# Altium project HYDRA_V3_BEACON.PrjPcb (part 1 of 2)
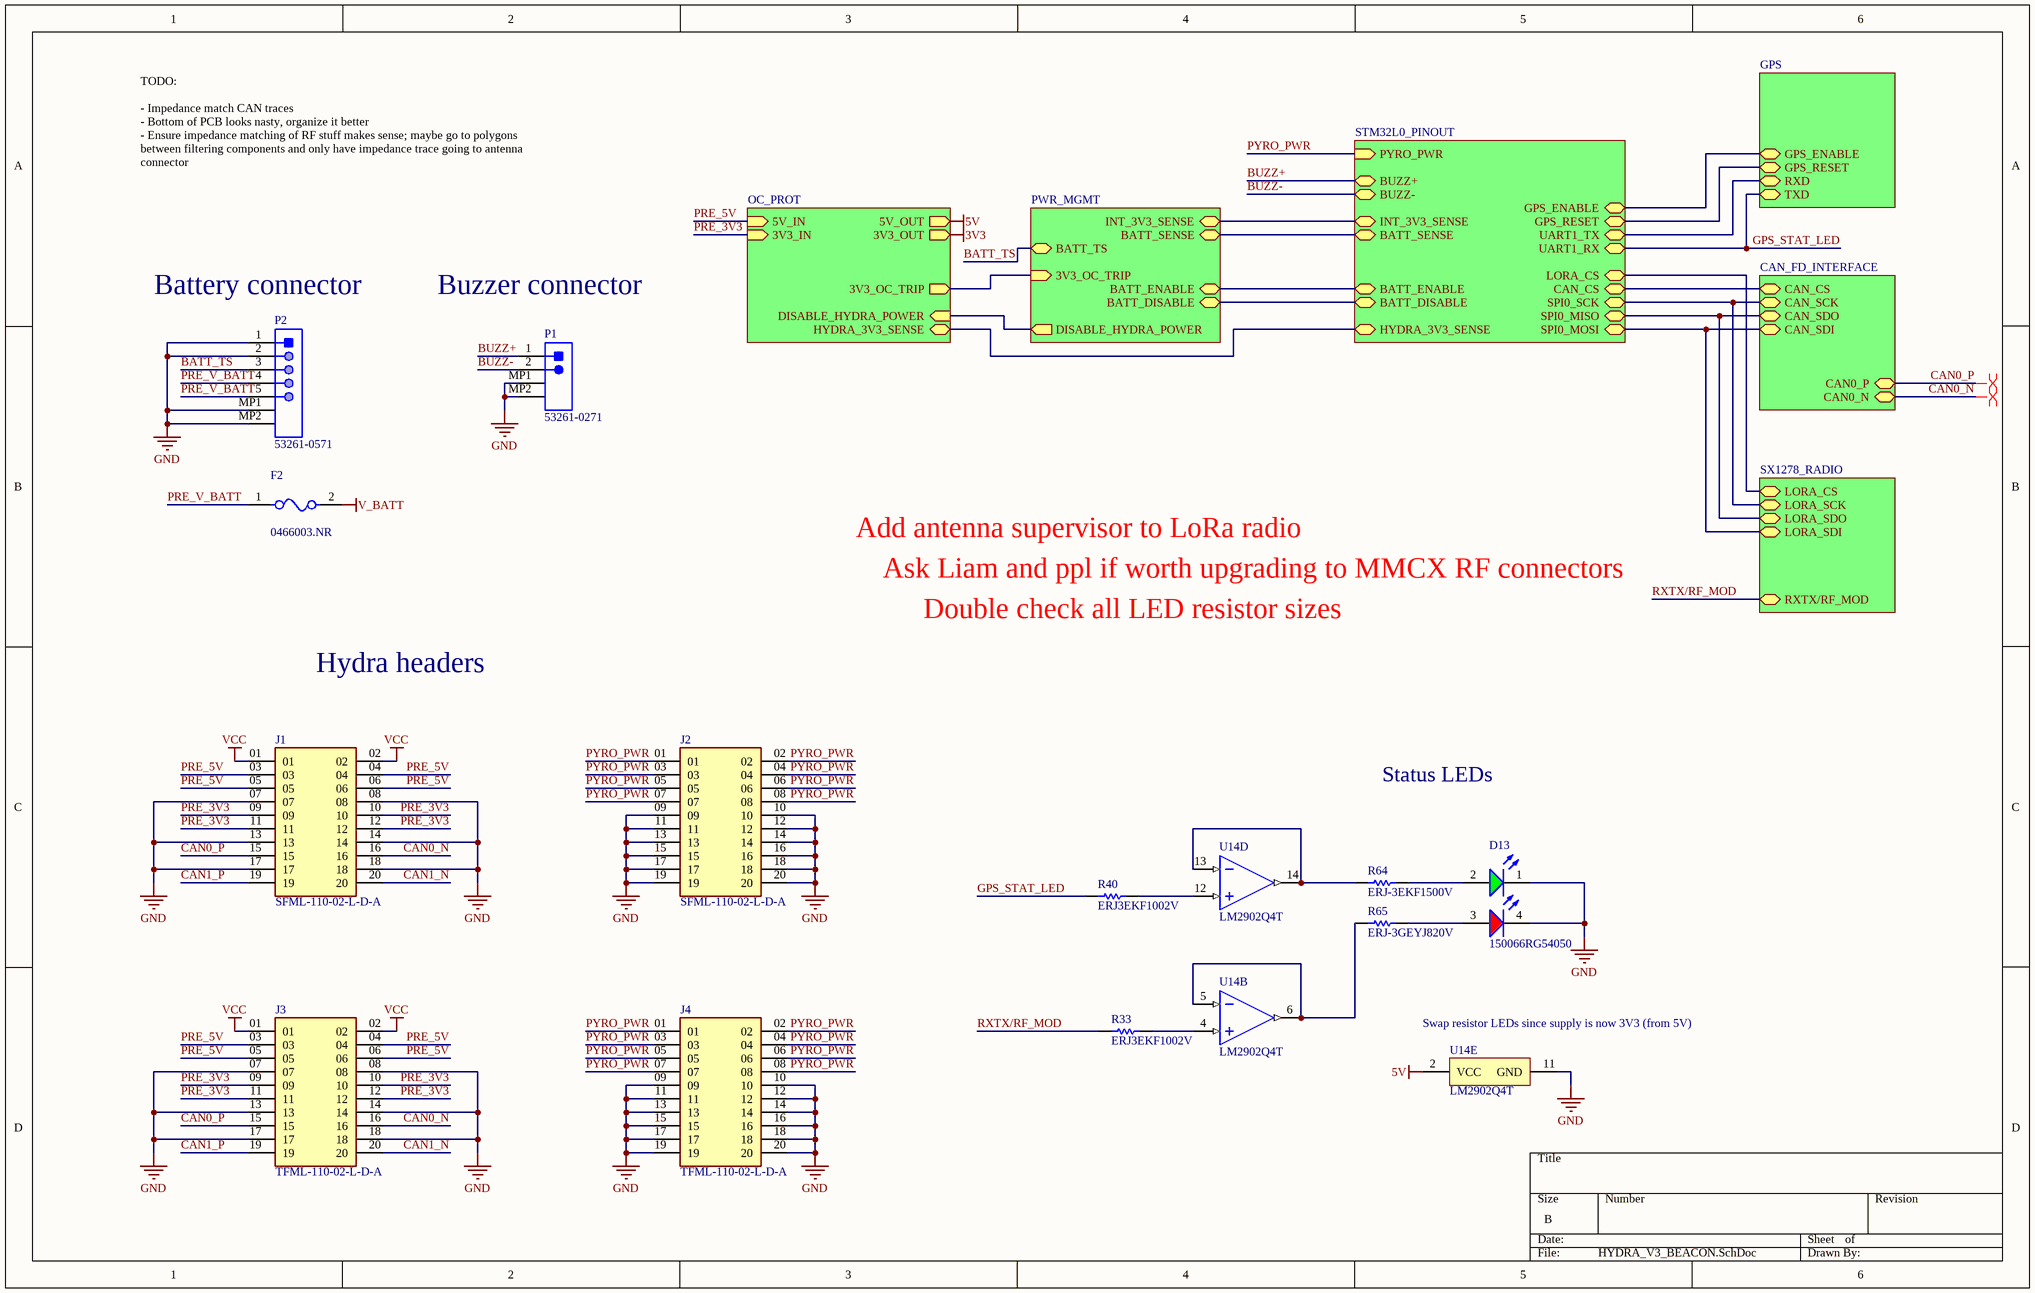
[diagram p0: HYDRA_V3_BEACON.SchDoc]
7 sheets, 171 parts. Net scope: hierarchical (ports join the sheet entries above them; power ports are global).
Board file: HYDRA_V3_BEACON.PcbDoc
Sheets:
  HYDRA_V3_BEACON.SchDoc
    OC_PROT = OC_PROT.SchDoc
    MCU_PINOUT = STM32L0_PINOUT.SchDoc
    CAN_FD = CAN_FD_INTERFACE.SchDoc
    GPS = GPS.SchDoc
    RADIO = SX1278_RADIO.SchDoc
    PWR_MGMT = PWR_MGMT.SchDoc

## Sheet HYDRA_V3_BEACON.SchDoc
size B; SheetNumber: 1; SheetTotal: 7

### Parts
D13  150066RG54050  [WL-SBCD_0606]
F2  0466003.NR  [FP-0466-MFG]
J1  SFML-110-02-L-D-A  [SFML-110-02-L-D-A-Footprint-1]
J2  SFML-110-02-L-D-A  [SFML-110-02-L-D-A-Footprint-1]
J3  TFML-110-02-L-D-A  [TFML-110-02-L-D-A-Footprint-1]
J4  TFML-110-02-L-D-A  [TFML-110-02-L-D-A-Footprint-1]
P1  53261-0271  [MOLX-53261-0271_V]
P2  53261-0571  [MOLX-52361-0571-5_V]
R33  ERJ3EKF1002V  [RESC1609X55X30LL15T15]
R40  ERJ3EKF1002V  [RESC1609X55X30LL15T15]
R64  ERJ-3EKF1500V  [RESC1608X55X30NL15T15]
R65  ERJ-3GEYJ820V  [RESC1608X55X30NL15T15]
U14  LM2902Q4T  [LM2902Q4T-Footprint-1]  (parts B,D,E of 5)

### Sub-sheets
CAN_FD = CAN_FD_INTERFACE: CAN0_P (bidir), CAN0_N (bidir), CAN_SCK (bidir), CAN_SDI (bidir), CAN_SDO (bidir), CAN_CS (bidir)
GPS = GPS: TXD (bidir), RXD (bidir), GPS_ENABLE (bidir), GPS_RESET (bidir)
MCU_PINOUT = STM32L0_PINOUT: PYRO_PWR (in), LORA_CS (bidir), CAN_CS (bidir), SPI0_SCK (bidir), SPI0_MISO (bidir), SPI0_MOSI (bidir), UART1_TX (bidir), UART1_RX (bidir), GPS_ENABLE (bidir), GPS_RESET (bidir), INT_3V3_SENSE (bidir), BATT_SENSE (bidir), BATT_ENABLE (bidir), BATT_DISABLE (bidir), BUZZ+ (bidir), BUZZ- (bidir), HYDRA_3V3_SENSE (bidir)
OC_PROT = OC_PROT: 5V_OUT (out), 5V_IN (in), 3V3_IN (in), 3V3_OUT (out), DISABLE_HYDRA_POWER (in), HYDRA_3V3_SENSE (bidir), 3V3_OC_TRIP (out)
PWR_MGMT = PWR_MGMT: BATT_ENABLE (bidir), BATT_DISABLE (bidir), INT_3V3_SENSE (bidir), BATT_SENSE (bidir), BATT_TS (bidir), DISABLE_HYDRA_POWER (out), 3V3_OC_TRIP (in)
RADIO = SX1278_RADIO: LORA_SCK (bidir), LORA_SDI (bidir), LORA_SDO (bidir), LORA_CS (bidir), RXTX/RF_MOD (bidir)

### Nets
5V: U14.2(VCC) ; sheet OC_PROT/5V_OUT
BUZZ+: J1.01 J1.02 J3.01 J3.02 P1.1 ; sheet MCU_PINOUT/BUZZ+  [also labelled VCC]
GND: D13.1(K) D13.4(K) J1.07 J1.08 J1.13 J1.14 J1.17 J1.18 J2.09 J2.10 J2.11 J2.12 J2.13 J2.14 J2.15 J2.16 J2.17 J2.18 J2.19 J2.20 J3.07 J3.08 J3.13 J3.14 J3.17 J3.18 J4.09 J4.10 J4.11 J4.12 J4.13 J4.14 J4.15 J4.16 J4.17 J4.18 J4.19 J4.20 P1.MP1 P1.MP2 P2.1 P2.2 P2.MP1 P2.MP2 U14.11(GND)
V_BATT: F2.2
3V3_OC_TP: sheet OC_PROT/3V3_OC_TRIP, sheet PWR_MGMT/3V3_OC_TRIP
BATT_DISABLE: sheet MCU_PINOUT/BATT_DISABLE, sheet PWR_MGMT/BATT_DISABLE
BATT_ENABLE: sheet MCU_PINOUT/BATT_ENABLE, sheet PWR_MGMT/BATT_ENABLE
BATT_SENSE: sheet MCU_PINOUT/BATT_SENSE, sheet PWR_MGMT/BATT_SENSE
BATT_TS: P2.3 ; sheet PWR_MGMT/BATT_TS
BUZZ-: P1.2 ; sheet MCU_PINOUT/BUZZ-
CAN0_N: J1.16 J3.16 ; sheet CAN_FD/CAN0_N
CAN0_P: J1.15 J3.15 ; sheet CAN_FD/CAN0_P
CAN1_N: J1.20 J3.20
CAN1_P: J1.19 J3.19
CAN_CS: sheet MCU_PINOUT/CAN_CS, sheet CAN_FD/CAN_CS
CAN_SCK: sheet MCU_PINOUT/SPI0_SCK, sheet CAN_FD/CAN_SCK, sheet RADIO/LORA_SCK
CAN_SDI: sheet MCU_PINOUT/SPI0_MOSI, sheet CAN_FD/CAN_SDI, sheet RADIO/LORA_SDI
CAN_SDO: sheet MCU_PINOUT/SPI0_MISO, sheet CAN_FD/CAN_SDO, sheet RADIO/LORA_SDO
DISABLE_HYDRA_POWER: sheet OC_PROT/DISABLE_HYDRA_POWER, sheet PWR_MGMT/DISABLE_HYDRA_POWER
GPS_ENABLE: sheet MCU_PINOUT/GPS_ENABLE, sheet GPS/GPS_ENABLE
GPS_RESET: sheet MCU_PINOUT/GPS_RESET, sheet GPS/GPS_RESET
GPS_STAT_LED: R40.1 ; sheet MCU_PINOUT/UART1_RX, sheet GPS/TXD
HYDRA_3V3_SENSE: sheet OC_PROT/HYDRA_3V3_SENSE, sheet MCU_PINOUT/HYDRA_3V3_SENSE
INT_3V3_SENSE: sheet MCU_PINOUT/INT_3V3_SENSE, sheet PWR_MGMT/INT_3V3_SENSE
LORA_CS: sheet MCU_PINOUT/LORA_CS, sheet RADIO/LORA_CS
PRE_3V3: J1.09 J1.10 J1.11 J1.12 J3.09 J3.10 J3.11 J3.12 ; sheet OC_PROT/3V3_IN  [project net 3V3_PRE_SHUNT]
PRE_5V: J1.03 J1.04 J1.05 J1.06 J3.03 J3.04 J3.05 J3.06 ; sheet OC_PROT/5V_IN
PRE_V_BATT: F2.1 P2.4 P2.5
PYRO_PWR: J2.01 J2.02 J2.03 J2.04 J2.05 J2.06 J2.07 J2.08 J4.01 J4.02 J4.03 J4.04 J4.05 J4.06 J4.07 J4.08 ; sheet MCU_PINOUT/PYRO_PWR
RXD: sheet MCU_PINOUT/UART1_TX, sheet GPS/RXD
RXTX/RF_MOD: R33.2 ; sheet RADIO/RXTX/RF_MOD
NetD13_2: D13.2(A) R64.2
NetD13_3: D13.3(A) R65.2
NetR33_1: R33.1 U14.4(2IN+)
NetR40_2: R40.2 U14.12(4IN+)
NetR64_1: R64.1 U14.13(4IN-) U14.14(4OUT)
NetR65_1: R65.1 U14.5(2IN-) U14.6(2OUT)

### Layout directives
differential pair: CAN0_N, CAN0_P

### Notes on the sheet
- TODO:
  - Impedance match CAN traces
  - Bottom of PCB looks nasty, organize it better
  - Ensure impedance matching of RF stuff makes sense; maybe go to polygons between filtering components and only have impedance trace going to antenna connector
- (near P2) Battery connector
- Buzzer connector
- Add antenna supervisor to LoRa radio
- Ask Liam and ppl if worth upgrading to MMCX RF connectors
- Double check all LED resistor sizes
- Hydra headers
- Status LEDs
- (near U14) Swap resistor LEDs since supply is now 3V3 (from 5V)

### Library data of the parts
D13 = CMP-004-00034-2: Led, Red/Grn, 180Mcd/230Mcd, 624Nm/525Nm Rohs Compliant: Yes
F2 = CMP-08605-000054-1: FUSE BOARD MNT 3A 32VAC/VDC 1206; Manufacturer: Littelfuse; Fuse Interrupt Ac Current: 50A; Fuse Voltage Drop: 75.99mV; Max Fuse Ac Voltage: 32V; Fuse I2T: 0.576A2Sec; Resistance: 0.019Ω; Fuse Blow Speed: Fast; Value: 0.019Ω; ComponentLink2Description: Datasheet; Fuse Current: 3A; RoHS: TRUE; Mouser Description: Surface Mount Fuses 32V 3A VFA Slimline; Height: 0.66mm; Octopart: https://octopart.com/0466003.nr-littelfuse-565175; Package: 0466; Fuse Interrupt Dc Current: 50A; Manufacturer Part Number: 0466003.NR; Temperature Range Low: -55°C; ComponentLink2URL: https://www.littelfuse.com/~/media/electronics/datasheets/fuses/littelfuse_fuse_466_datasheet.pdf.pdf; Digikey Description: FUSE BOARD MNT 3A 32VAC/VDC 1206; Voltage Rating: 32V; Category: Fuse; Lead Free: Yes; Device Class L2: Fuses; Automotive: No; Max Fuse Dc Voltage: 32V; Temperature Range High: +90°C; Device Class L3: unset; Device Class L1: Circuit Protection; Temperature: -55°C to +90°C
J1 J2 = CMP-002-00076-2: Headers & Wire Housings .050 Tiger Eye High-Reliability Locking Socket Strip
J3 J4 = CMP-002-00077-1: Conn Shrouded Header (4 Sides) HDR 20 POS 1.27mm Solder ST Top Entry SMD TIGER EYE™ Tube
P1 = CMP-2000-05633-1: PicoBlade(TM) Header, Right Angle, -40 to 85 degC, 2-Pin SMD, RoHS, Tape and Reel; Current - Max: 1A; Brand: Molex; Voltage Rating: 125V; Number of Positions: 2; Pitch: 1.25mm; Package Version: Rev. H, 11/2014; Factory Pack Quantity: 1000; Datasheet URL: http://www.molex.com/webdocs/datasheets/pdf/en-us/0532610271_PCB_HEADERS.pdf; Datasheet Version: 03/2016; Housing Material: Thermoplastic; RoHS: Details; Product Type: Headers; Number of Rows: 1; Termination Style: SMD; Mounting Technology: SurfaceMount; Number of Positions / Contacts: 2; Package URL: http://www.molex.com/pdm_docs/sd/532610271_sd.pdf; Mounting Angle: Right; Mounting Style: SMD/SMT; Manufacturer: Molex; Product Category: 1.25mmConnectors; Tradename: PicoBlade; Voltage - Max: 125V; Manufacturer URL: http://www.molex.com/; Series: 53261; Package Description: 2-Leads Header, Pitch 1.25 mm, Mated Height 3.4 mm; Package Reference: 53261-0271; Current Rating: 1A; Contact Plating: Tin; Contact Material: PhosphorBronze; Type: Shrouded; Packaging: Reel
P2 = CMP-2000-05249-1: Male Header, Pitch 1.25 mm, 1 x 5 Position, Height 3.4 mm, RoHS, Tape and Reel; Brand: Molex; Mounting Angle: Right; Number of Positions: 5; Voltage Rating: 125V; Current Rating: 1A; Pitch: 1.25mm; Datasheet Version: Rev. D, 04/2004; Housing Material: Thermoplastic; Series: 53261; RoHS: Details; Product Category: Headers&WireHousings; Datasheet URL: http://datasheet.octopart.com/532610571-Molex-datasheet-8343080.pdf; Manufacturer URL: http://www.molex.com/; Contact Material: PhosphorBronze; Tradename: PicoBlade; Number of Rows: 1; Product Type: Headers; Manufacturer: Molex; Type: Shrouded; Termination Style: SMD; Mounting Style: SMD/SMT; Factory Pack Quantity: 1000; Contact Plating: Tin; Packaging: Reel; Number of Positions / Contacts: 5
R33 R40 = CMP-1012-00623-3: Chip Resistor, 10 KOhm, +/- 1%, 0.1 W, -55 to 155 degC, 0603 (1608 Metric), RoHS, Tape and Reel; Manufacturer: Panasonic; Voltage Rating: 75V; Case\/Package: 0603; Power Rating: 100mW; Resistance: 10KOhm; Temperature Coefficient: 100ppm\/degreesC; Number of Pins: 2; Package Reference: 603; Depth: 0.8mm; Mount: SurfaceMount; Package Description: 2-Pin Surface Mount Device, Body 1.6 x 0.85 mm; Datasheet Version: 02/2017; Length: 1.6mm; Lead Free: LeadFree; Height: 0.45mm; Number of Terminations: 2; Max Power Dissipation: 100mW; Min Operating Temperature: -55degC; Datasheet URL: https://industrial.panasonic.com/cdbs/www-data/pdf/RDA0000/AOA0000C304.pdf; Termination: SMD/SMT; Case Code (Metric): 1608; Case Code (Imperial): 0603; Tolerance: 1%; Max Operating Temperature: 155degC; RoHSCompliant: true; Voltage Rating (DC): 75V; Radiation Hardening: No; Packaging: TapeandReel; Composition: ThickFilm; Mounting Technology: SurfaceMount; Manufacturer URL: http://www.panasonic.com/; Width: 0.031inch; REACH SVHC: NoSVHC; Contact Plating: Tin; Military Standard: Not; Package Quantity: 1
R64 = CMP-2000-00256-1: Manufacturer: Panasonic; Part Number: ERJ-3EKF1500V
R65 = CMP-1012-00048-2: Manufacturer: Panasonic; Part Number: ERJ-3GEYJ820V
U14 = CMP-014-00004-1: LM2902 Series 30 V 1.3 MHz Low-Power Quad Operational Amplifier - QFN-16 (3x3)

## Sheet OC_PROT.SchDoc
size C; SheetNumber: 2; SheetTotal: 7
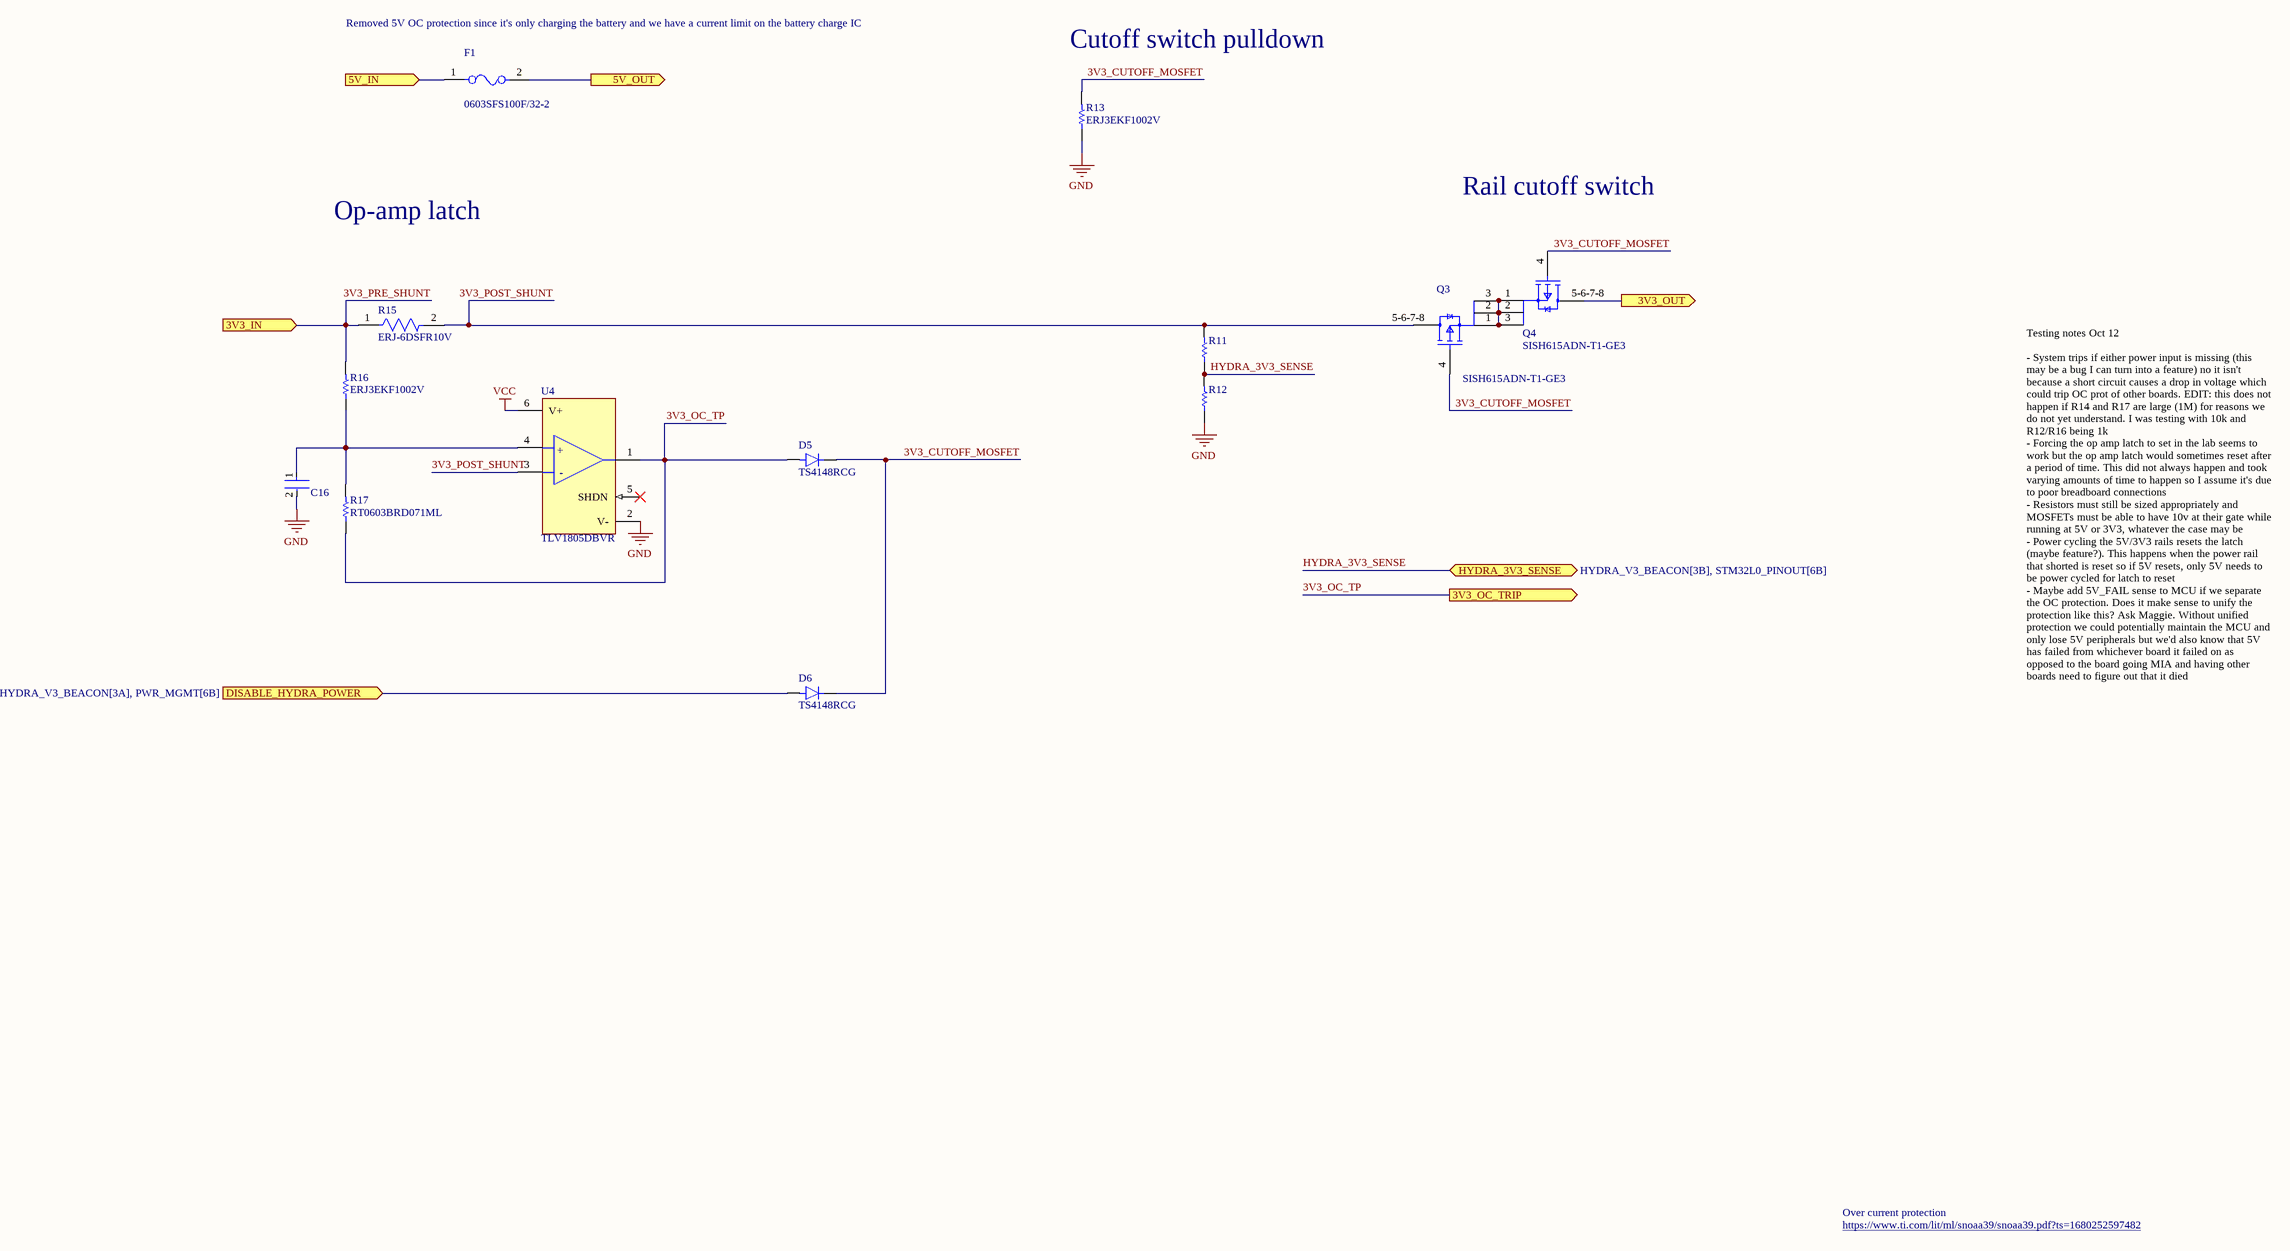
[diagram p1: OC_PROT.SchDoc]

### Parts
C16  C0402C104K8PACTU  [FP-C0402-BB-MFG]  (value not drawn)
D5  TS4148RCG  [TS4148RCG-Footprint-1]
D6  TS4148RCG  [TS4148RCG-Footprint-1]
F1  0603SFS100F/32-2  [FP-0603SFS-MFG]
Q3  SISH615ADN-T1-GE3  [SISH615ADN-T1-GE3-Footprint-1]
Q4  SISH615ADN-T1-GE3  [SISH615ADN-T1-GE3-Footprint-1]
R11  ERJ3EKF1002V  [RESC1609X55X30LL15T15]  (value not drawn)
R12  ERJ3EKF1002V  [RESC1609X55X30LL15T15]  (value not drawn)
R13  ERJ3EKF1002V  [RESC1609X55X30LL15T15]
R15  ERJ-6DSFR10V  [FP-ERJ6D-MFG]
R16  ERJ3EKF1002V  [RESC1609X55X30LL15T15]
R17  RT0603BRD071ML  [RESC1608X55X30NL20T20]
U4  TLV1805DBVR  [FP-DBV0006A-IPC_C]

### Ports
3V3_IN (in, see HYDRA_V3_BEACON[3A]), 3V3_OC_TRIP (out), 3V3_OUT (out, see HYDRA_V3_BEACON[3A]), 5V_IN (in, see HYDRA_V3_BEACON[3A]), 5V_OUT (out, see HYDRA_V3_BEACON[3A]), DISABLE_HYDRA_POWER (in, see HYDRA_V3_BEACON[3A], PWR_MGMT[6B]), HYDRA_3V3_SENSE (bidir, see HYDRA_V3_BEACON[3B], STM32L0_PINOUT[6B])

### Nets
3V3: Q4.5-6-7-8(D) ; port 3V3_OUT
5V: F1.2 ; port 5V_OUT
GND: C16.2 R12.1 R13.1 U4.2(V-)
VCC: U4.6(V+)  [project net BUZZ+]
3V3_CUTOFF_MOSFET: D5.C(K) D6.C(K) Q3.4(G) Q4.4(G) R13.2
3V3_OC_TP: D5.A R17.1 U4.1(OUT) ; port 3V3_OC_TRIP
3V3_POST_SHUNT: Q3.5-6-7-8(D) R11.2 R15.2 U4.3(-IN)
3V3_PRE_SHUNT: R15.1 R16.2 ; port 3V3_IN
DISABLE_HYDRA_POWER: D6.A ; port DISABLE_HYDRA_POWER
HYDRA_3V3_SENSE: R11.1 R12.2 ; port HYDRA_3V3_SENSE
PRE_5V: F1.1 ; port 5V_IN
NetC16_1: C16.1 R16.1 R17.2 U4.4(+IN)
NetQ3_1: Q3.1(S) Q3.2(S) Q3.3(S) Q4.1(S) Q4.2(S) Q4.3(S)

Not connected (* = marked no-connect by the designer): U4 5(SHDN)*

### Notes on the sheet
- Removed 5V OC protection since it's only charging the battery and we have a current limit on the battery charge IC
- Cutoff switch pulldown
- Op-amp latch
- Rail cutoff switch
- Testing notes Oct 12
  - System trips if either power input is missing (this may be a bug I can turn into a feature) no it isn't because a short circuit causes a drop in voltage which could trip OC prot of other boards. EDIT: this does not happen if R14 and R17 are large (1M) for reasons we do not yet understand. I was testing with 10k and R12/R16 being 1k
  - Forcing the op amp latch to set in the lab seems to work but the op amp latch would sometimes reset after a period of time. This did not always happen and took varying amounts of time to happen so I assume it's due to poor breadboard connections
  - Resistors must still be sized appropriately and MOSFETs must be able to have 10v at their gate while running at 5V or 3V3, whatever the case may be
  - Power cycling the 5V/3V3 rails resets the latch (maybe feature?). This happens when the power rail that shorted is reset so if 5V resets, only 5V needs to be power cycled for latch to reset
  - Maybe add 5V_FAIL sense to MCU if we separate the OC protection. Does it make sense to unify the protection like this? Ask Maggie. Without unified protection we could potentially maintain the MCU and only lose 5V peripherals but we'd also know that 5V has failed from whichever board it failed on as opposed to the board going MIA and having other boards need to figure out that it died
- https://www.ti.com/lit/ml/snoaa39/snoaa39.pdf?ts=1680252597482
- Over current protection
- (in symbol CMP-04896-000098-1) +; -

### Library data of the parts
C16 = CMP-2008-02046-2: CAP CER 0.1UF 10V X5R 0402; Manufacturer: Kemet; Material: Ceramic; Capacitance: 0.10 μF; Temperature Coefficient: 15%; Tolerance: 0.1; Value: 0.10 μF; Package: C0402-BB; Temperature: -55°C to +125°C; ComponentLink2Description: Datasheet; Temperature Characteristic: X5R; Device Class L1: Passive Components; Height: 0.55mm; Lead Free: Yes; ComponentLink2URL: https://content.kemet.com/datasheets/KEM_C1002_X7R_SMD.pdf; Device Class L2: Capacitors; Temperature Range Low: -55°C; Temperature Range High: +125°C; RoHS: TRUE; Octopart: https://octopart.com/c0402c104k8pactu-kemet-140039; Automotive: No; Mouser Description: Capacitor 100 nF 10 VDC 0402; Category: Cap; Voltage Rating: 10 V; Digikey Description: CAP CER 0.1UF 10V X5R 0402; Ipc Land Pattern Name: CAPC10050X50; Device Class L3: Ceramic Capacitors; Manufacturer Part Number: C0402C104K8PACTU
D5 D6 = CMP-004-00036-1: SMD Si-Diode 75V 100mA 0603
F1 = CMP-08605-000034-1: FUSE BOARD MOUNT 1A 32VDC 0603; Manufacturer: Littelfuse; Resistance: 0.2Ω; Fuse Interrupt Dc Current: 50A; Max Fuse Dc Voltage: 32V; Fuse I2T: 0.093A2Sec; Fuse Blow Speed: Slow; Value: 0.2Ω; Device Class L1: Circuit Protection; Device Class L3: unset; Category: Fuse; Temperature Range High: +125°C; ComponentLink2Description: Datasheet; Automotive: No; Device Class L2: Fuses; Lead Free: Yes; Fuse Current: 1A; Temperature: -55°C to +125°C; Digikey Description: FUSE BOARD MOUNT 1A 32VDC 0603; ComponentLink2URL: https://www.littelfuse.com/~/media/electronics/datasheets/fuses/littelfuse_fuse_sfs_datasheet.pdf.pdf; Octopart: https://octopart.com/0603sfs100f%2F32-2-littelfuse-74214378; Voltage Rating: 32V; RoHS: TRUE; Manufacturer Part Number: 0603SFS100F/32-2; Package: 0603SFS; Height: 0.95mm; Ipc Land Pattern Name: CAPC16080X80; Temperature Range Low: -55°C
Q3 Q4 = CMP-013-00036-1: Trans MOSFET P-CH 20V 22.1A 8-Pin PowerPAK 1212 EP T/R
R11-R13 R16 = CMP-1012-00623-3: as R33 on sheet HYDRA_V3_BEACON; Number of Pins: 2; Package Reference: 603; Depth: 0.8mm; Mount: SurfaceMount; Package Description: 2-Pin Surface Mount Device, Body 1.6 x 0.85 mm; Datasheet Version: 02/2017; Length: 1.6mm; Lead Free: LeadFree; Height: 0.45mm; Number of Terminations: 2; Max Power Dissipation: 100mW; Min Operating Temperature: -55degC; Datasheet URL: https://industrial.panasonic.com/cdbs/www-data/pdf/RDA0000/AOA0000C304.pdf; Termination: SMD/SMT; Case Code (Metric): 1608; Case Code (Imperial): 0603; Tolerance: 1%; Max Operating Temperature: 155degC; RoHSCompliant: true; Voltage Rating (DC): 75V; Radiation Hardening: No; Packaging: TapeandReel; Composition: ThickFilm; Mounting Technology: SurfaceMount; Manufacturer URL: http://www.panasonic.com/; Width: 0.031inch; REACH SVHC: NoSVHC; Contact Plating: Tin; Military Standard: Not; Package Quantity: 1
R15 = CMP-05422-000098-1: RES 0.1 OHM 1% 1/2W 0805; Temperature Coefficient: 150ppm/°C; Resistance: 100mR; Max Power Dissipation: 500mW; Tolerance: 1%; Length: 0.079inch; Features: Automotive AEC-Q200; Width: 0.049inch; Resistor Type: Thick Film; Case Code (Metric): 2012; Number of Terminations: 2; Max Operating Temperature: 155°C; Case/Package: 0805; Height: 0.028inch; Packaging: Cut Tape; Case Code (Imperial): 0805; Min Operating Temperature: -55°C
R17 = CMP-2000-00925-1: NOT PANASONIC, THIS IS A 1M RESISTORhttps://www.yageo.com/upload/media/product/productsearch/datasheet/rchip/PYu-RT_1-to-0.01_RoHS_L_13.pdf; Part Number: ERA-3AEB163V; Manufacturer: Panasonic
U4 = CMP-04896-000098-1: 40V, RAIL-TO-RAIL INPUT, PUSH-PU

## Sheet STM32L0_PINOUT.SchDoc
size B; SheetNumber: 3; SheetTotal: 7
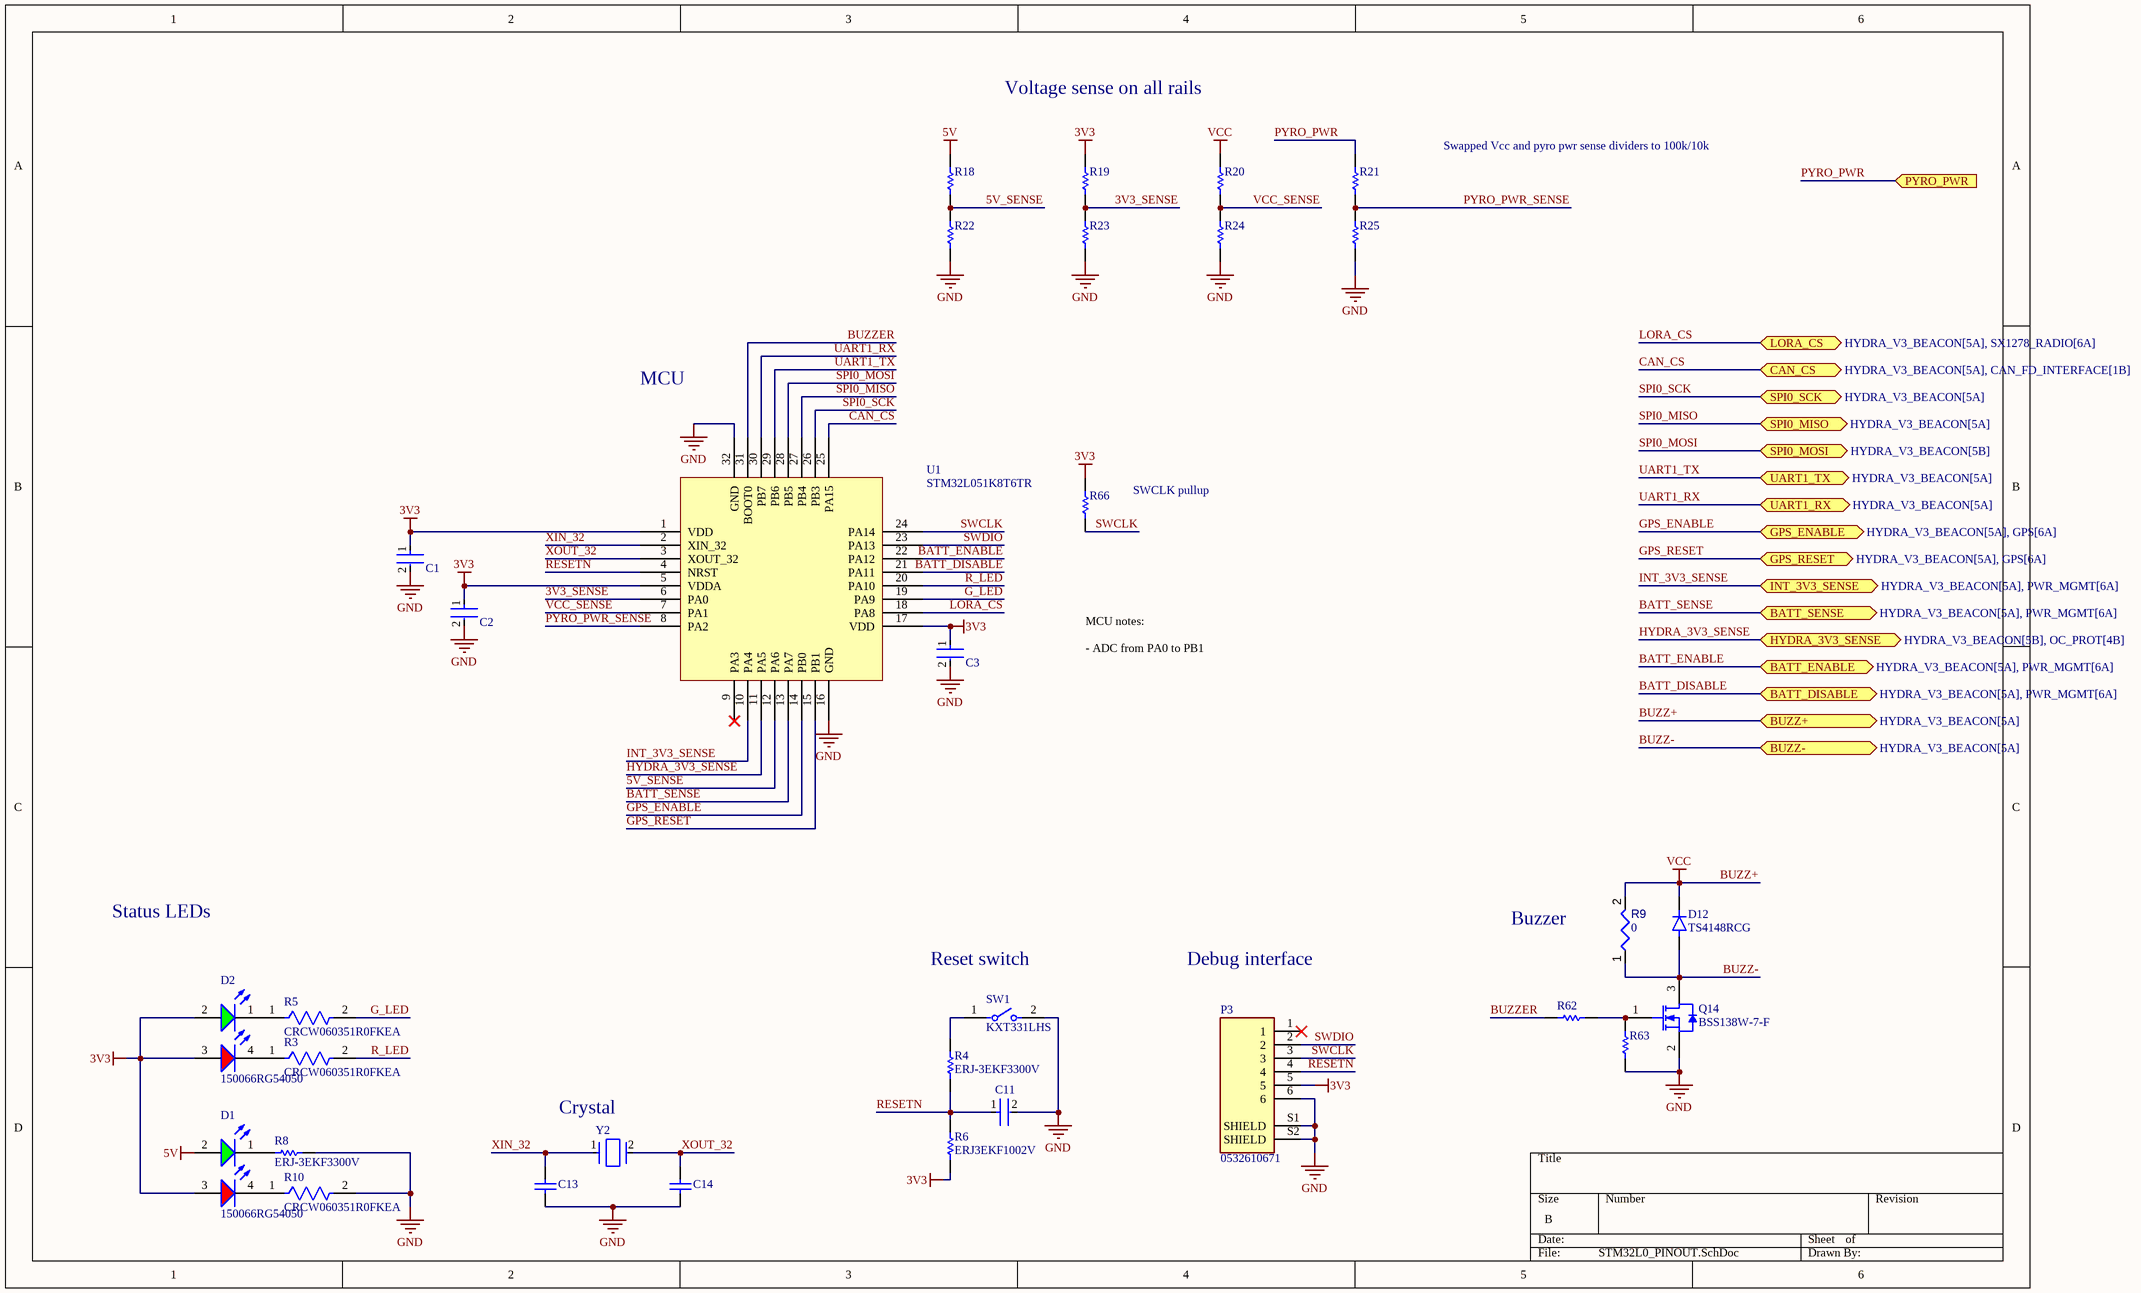
[diagram p2: STM32L0_PINOUT.SchDoc]

### Parts
C1  C0402C104K8PACTU  [FP-C0402-BB-MFG]  (value not drawn)
C2  C0402C104K8PACTU  [FP-C0402-BB-MFG]  (value not drawn)
C3  C0402C104K8PACTU  [FP-C0402-BB-MFG]  (value not drawn)
C11  C0402C104K8PACTU  [FP-C0402-BB-MFG]  (value not drawn)
C13  CC0603JRNPO9BN180  [CAPC1608X90X40LL10T20]  (value not drawn)
C14  CC0603JRNPO9BN180  [CAPC1608X90X40LL10T20]  (value not drawn)
D1  150066RG54050  [WL-SBCD_0606]
D2  150066RG54050  [WL-SBCD_0606]
D12  TS4148RCG  [TS4148RCG-Footprint-1]
P3  0532610671  [0532610671-Footprint-1]
Q14  BSS138W-7-F  [DIOD-SOT323-3_V]
R3  CRCW060351R0FKEA  [FP-CRCW0603-e3-MFG]
R4  ERJ-3EKF3300V  [RESC1608X55X30LL15T15]
R5  CRCW060351R0FKEA  [FP-CRCW0603-e3-MFG]
R6  ERJ3EKF1002V  [RESC1609X55X30LL15T15]
R8  ERJ-3EKF3300V  [RESC1608X55X30LL15T15]
R9  value 0  [RESC0603(1608)_L]  (hidden comment: 0R3J)
R10  CRCW060351R0FKEA  [FP-CRCW0603-e3-MFG]
R18  ERJ3EKF1002V  [RESC1609X55X30LL15T15]  (value not drawn)
R19  ERJ3EKF1002V  [RESC1609X55X30LL15T15]  (value not drawn)
R20  ERJ-3EKF1003V  [RESC1608X55X30ML15T15]  (value not drawn)
R21  ERJ-3EKF1003V  [RESC1608X55X30ML15T15]  (value not drawn)
R22  ERJ3EKF1002V  [RESC1609X55X30LL15T15]  (value not drawn)
R23  ERJ3EKF1002V  [RESC1609X55X30LL15T15]  (value not drawn)
R24  ERJ3EKF1002V  [RESC1609X55X30LL15T15]  (value not drawn)
R25  ERJ3EKF1002V  [RESC1609X55X30LL15T15]  (value not drawn)
R62  ERJ-3EKF1001V  [RESC1608X55X30LL15T15]  (value not drawn)
R63  ERJ3EKF1002V  [RESC1609X55X30LL15T15]  (value not drawn)
R66  ERJ3EKF1002V  [RESC1609X55X30LL15T15]  (value not drawn)
SW1  KXT331LHS  [FP-KXT331LHS-MFG]
U1  STM32L051K8T6TR  [CQFP80P1115X1115X160-32N]
Y2  ECS-.327-12.5-1210-TR  [FP-ECX-1210-MFG]  (value not drawn)

### Ports
BATT_DISABLE (bidir, see HYDRA_V3_BEACON[5A], PWR_MGMT[6A]), BATT_ENABLE (bidir, see HYDRA_V3_BEACON[5A], PWR_MGMT[6A]), BATT_SENSE (bidir, see HYDRA_V3_BEACON[5A], PWR_MGMT[6A]), BUZZ+ (bidir, see HYDRA_V3_BEACON[5A]), BUZZ- (bidir, see HYDRA_V3_BEACON[5A]), CAN_CS (bidir, see HYDRA_V3_BEACON[5A], CAN_FD_INTERFACE[1B]), GPS_ENABLE (bidir, see HYDRA_V3_BEACON[5A], GPS[6A]), GPS_RESET (bidir, see HYDRA_V3_BEACON[5A], GPS[6A]), HYDRA_3V3_SENSE (bidir, see HYDRA_V3_BEACON[5B], OC_PROT[4B]), INT_3V3_SENSE (bidir, see HYDRA_V3_BEACON[5A], PWR_MGMT[6A]), LORA_CS (bidir, see HYDRA_V3_BEACON[5A], SX1278_RADIO[6A]), PYRO_PWR (in, see HYDRA_V3_BEACON[5A]), SPI0_MISO (bidir, see HYDRA_V3_BEACON[5A]), SPI0_MOSI (bidir, see HYDRA_V3_BEACON[5B]), SPI0_SCK (bidir, see HYDRA_V3_BEACON[5A]), UART1_RX (bidir, see HYDRA_V3_BEACON[5A]), UART1_TX (bidir, see HYDRA_V3_BEACON[5A])

### Nets
3V3: C1.1 C2.1 C3.1 D1.3(A) D2.2(A) D2.3(A) P3.5 R6.1 R19.2 R66.2 U1.1(VDD) U1.5(VDDA) U1.17(VDD)
5V: D1.2(A) R18.2
BUZZ+: D12.C(K) R9.2 R20.2 ; port BUZZ+  [also labelled VCC]
GND: C1.2 C2.2 C3.2 C11.2 C13.1 C14.1 P3.6 P3.S1(SHIELD) P3.S2(SHIELD) Q14.2(S) R8.2 R10.2 R22.1 R23.1 R24.1 R25.1 R63.2 SW1.2 U1.16(GND) U1.32(GND)
3V3_SENSE: R19.1 R23.2 U1.6(PA0)
5V_SENSE: R18.1 R22.2 U1.12(PA6)
BATT_DISABLE: U1.21(PA11) ; port BATT_DISABLE
BATT_ENABLE: U1.22(PA12) ; port BATT_ENABLE
BATT_SENSE: U1.13(PA7) ; port BATT_SENSE
BUZZ-: D12.A Q14.3(D) R9.1 ; port BUZZ-
BUZZER: R62.2 U1.31(BOOT0)
CAN_CS: U1.25(PA15) ; port CAN_CS
G_LED: R5.2 U1.19(PA9)
GPS_ENABLE: U1.14(PB0) ; port GPS_ENABLE
GPS_RESET: U1.15(PB1) ; port GPS_RESET
HYDRA_3V3_SENSE: U1.11(PA5) ; port HYDRA_3V3_SENSE
INT_3V3_SENSE: U1.10(PA4) ; port INT_3V3_SENSE
LORA_CS: U1.18(PA8) ; port LORA_CS
PYRO_PWR: R21.2 ; port PYRO_PWR
PYRO_PWR_SENSE: R21.1 R25.2 U1.8(PA2)
R_LED: R3.2 U1.20(PA10)
RESETN: C11.1 P3.4 R4.1 R6.2 U1.4(NRST)
SPI0_MISO: U1.27(PB4) ; port SPI0_MISO  [project net CAN_SDO]
SPI0_MOSI: U1.28(PB5) ; port SPI0_MOSI  [project net CAN_SDI]
SPI0_SCK: U1.26(PB3) ; port SPI0_SCK  [project net CAN_SCK]
SWCLK: P3.3 R66.1 U1.24(PA14)
SWDIO: P3.2 U1.23(PA13)
UART1_RX: U1.30(PB7) ; port UART1_RX  [project net GPS_STAT_LED]
UART1_TX: U1.29(PB6) ; port UART1_TX  [project net RXD]
VCC_SENSE: R20.1 R24.2 U1.7(PA1)
XIN_32: C13.2 U1.2(XIN_32) Y2.1(In/Out)
XOUT_32: C14.2 U1.3(XOUT_32) Y2.2(Out/In)
NetD1_1: D1.1(K) R8.1
NetD1_4: D1.4(K) R10.1
NetD2_1: D2.1(K) R5.1
NetD2_4: D2.4(K) R3.1
NetQ14_1: Q14.1(G) R62.1 R63.1
NetR4_2: R4.2 SW1.1

Not connected (* = marked no-connect by the designer): P3 1*; U1 9(PA3)*

### Notes on the sheet
- Voltage sense on all rails
- Swapped Vcc and pyro pwr sense dividers to 100k/10k
- MCU
- (near R66) SWCLK pullup
- MCU notes:
  - ADC from PA0 to PB1
- Status LEDs
- (near SW1) Reset switch
- Debug interface
- Buzzer
- (near Y2) Crystal

### Library data of the parts
C1-C3 C11 = CMP-2008-02046-2: as C16 on sheet OC_PROT; Package: C0402-BB; Temperature: -55°C to +125°C; ComponentLink2Description: Datasheet; Temperature Characteristic: X5R; Device Class L1: Passive Components; Height: 0.55mm; Lead Free: Yes; ComponentLink2URL: https://content.kemet.com/datasheets/KEM_C1002_X7R_SMD.pdf; Device Class L2: Capacitors; Temperature Range Low: -55°C; Temperature Range High: +125°C; RoHS: TRUE; Octopart: https://octopart.com/c0402c104k8pactu-kemet-140039; Automotive: No; Mouser Description: Capacitor 100 nF 10 VDC 0402; Category: Cap; Voltage Rating: 10 V; Digikey Description: CAP CER 0.1UF 10V X5R 0402; Ipc Land Pattern Name: CAPC10050X50; Device Class L3: Ceramic Capacitors; Manufacturer Part Number: C0402C104K8PACTU
C13 C14 = CMP-1659-00030-1: Chip Capacitor, 18 pF, +/- 5%, 50 V, -55 to 125 degC, 0603 (1608 Metric), RoHS, Tape and Reel; Voltage Rating: 50 V; Case\Package: 0603; Power Rating: 100 mW; Resistance: 68.1 Ohm; Tolerance: 1%; Case Code (Metric): 1608; Max Operating Temperature: 155 degC; RoHSCompliant: true; Case Code (Imperial): 0603; ComponentLink2Description: Datasheet; Package Quantity: 200; PackageReference: 0603; ComponentLink2URL: http://www.yageo.com/NewPortal/yageodocoutput?fileName=/pdf/MLCC/UPY-GP_NP0_16V-to-50V_14.pdf; Length: 1.6 mm; DatasheetVersion: Rev. 14, 07/2016; Min Operating Temperature: -55 degC; ComponentLink1URL: http://www.yageo.com/; Width: 0.8 mm; ComponentLink1Description: Manufacturer URL; Height: 0.45 mm; Radiation Hardening: No; PackageDescription: 2-Pin Surface Mount Device, Body 1.6 x 0.8 mm; Packaging: Tape and Reel
D1 D2 = CMP-004-00034-2: as D13 on sheet HYDRA_V3_BEACON
D12 = CMP-004-00036-1: SMD Si-Diode 75V 100mA 0603
P3 = CMP-002-00079-1: Conn Shrouded Header (4 Sides) HDR 6 POS 1.25mm Solder RA Side Entry SMD PicoBlade™ T/R
Q14 = CMP-2000-05968-1: N-Channel Enhancement Mode Mosfet, 50 V, 200 mA, -55 to 150 degC, 6-Pin SOT-323, RoHS, Tape and Reel; Typical Turn-Off Delay Time: 20ns; Number of Channels: 1Channel; Type: EnhancementModeFieldEffectTransistor; Brand: DiodesIncorporated; Vds - Drain-Source Breakdown Voltage: 75V; Vgs - Gate-Source Voltage: 20V; Rds On - Drain-Source Resistance: 1.4Ohms; Transistor Type: 1N-Channel; Configuration: Single; Unit Weight: 0.000212oz; Pd - Power Dissipation: 200mW; Id - Continuous Drain Current: 200mA; Forward Transconductance - Min: 0.1S; Manufacturer URL: http://www.diodes.com/; Series: BSS138; Package Description: 3-Pin Small Outline Transistor, Body 2 x 1.25 mm, Pitch 0.65 mm; Mounting Technology: SurfaceMount; Product Category: MOSFET; RoHS: True; Maximum Operating Temperature: +150C; Height: 1mm; Length: 2.2mm; Technology: Si; Width: 1.35mm; Datasheet URL: http://www.diodes.com/_files/datasheets/ds30206.pdf; Manufacturer: DiodesIncorporated; Package / Case: SOT-323-3; Typical Turn-On Delay Time: 20ns; Transistor Polarity: N-Channel; Factory Pack Quantity: 3000; Packaging: Reel; Product: MOSFETSmallSignal; Datasheet Version: Rev. 11-2, 09/2013; Package Reference: SOT323; Minimum Operating Temperature: -55C; Mounting Style: SMD/SMT; Channel Mode: Enhancement
R3 R5 R10 = CMP-2000-03446-2: RES Thick Film, 51Ω, 1%, 0.1W, 100ppm/°C, 0603; Power Rating: 100mW; Voltage Rating: 75V; Resistance: 51R; Military Standard: Not; Case Code (Imperial): 0603; Max Operating Temperature: 155°C; Temperature Coefficient: 100ppm/°C; Lead Free: Lead Free; Weight: 7.1E-05oz; Number of Pins: 2; Package Quantity: 10; Case/Package: 0603; Termination: SMD/SMT; Min Operating Temperature: -55°C; Tolerance: 1%; Contact Plating: Tin; Height: 0.45mm; Working Voltage: 75V; Radiation Hardening: No; Packaging: Tape and Reel; Composition: Thick Film; Max Power Dissipation: 100mW; Width: 0.85mm; Depth: 0.85mm; Length: 1.55mm; Case Code (Metric): 1608; Voltage Rating (DC): 75V; Number of Terminations: 2; Features: Automotive AEC-Q200
R4 R8 = CMP-2000-00435-2: Chip Resistor, 330 Ohm, +/- 1%, 0.1 W, -55 to 155 degC, 0603 (1608 Metric), RoHS, Tape and Reel; Gender: Male; Mating Cycles: 10000; Current Rating: 500 mA; Voltage Rating: 10 V; REACH SVHC: No SVHC; PackageDescription: 2-Pin Surface Mount Device, Body 1.6 x 0.85 mm; Contact Finish: Gold; Pins: 8; ComponentLink1Description: Manufacturer URL; Packaging: Tape and Reel; Max Operating Temperature: 85 degC; Contact Material: Copper; Height: 1.45 mm; Width: 1.45 mm; DatasheetVersion: Apr-15; Package Quantity: 1500; Contact Plating: Gold; PackageReference: 0603; Mount: Surface Mount; Lead Pitch: 1.1 mm; Min Operating Temperature: -25 degC; ComponentLink1URL: http://www.panasonic.com/; ComponentLink2URL: http://industrial.panasonic.com/cdbs/www-data/pdf/RDA0000/AOA0000C86.pdf; Length: 13.7 mm; ComponentLink2Description: Datasheet; RoHSCompliant: true
R6 R18 R19 R22-R25 R63 R66 = CMP-1012-00623-3: as R33 on sheet HYDRA_V3_BEACON; Number of Pins: 2; Package Reference: 603; Depth: 0.8mm; Mount: SurfaceMount; Package Description: 2-Pin Surface Mount Device, Body 1.6 x 0.85 mm; Datasheet Version: 02/2017; Length: 1.6mm; Lead Free: LeadFree; Height: 0.45mm; Number of Terminations: 2; Max Power Dissipation: 100mW; Min Operating Temperature: -55degC; Datasheet URL: https://industrial.panasonic.com/cdbs/www-data/pdf/RDA0000/AOA0000C304.pdf; Termination: SMD/SMT; Case Code (Metric): 1608; Case Code (Imperial): 0603; Tolerance: 1%; Max Operating Temperature: 155degC; RoHSCompliant: true; Voltage Rating (DC): 75V; Radiation Hardening: No; Packaging: TapeandReel; Composition: ThickFilm; Mounting Technology: SurfaceMount; Manufacturer URL: http://www.panasonic.com/; Width: 0.031inch; REACH SVHC: NoSVHC; Contact Plating: Tin; Military Standard: Not; Package Quantity: 1
R9 = CMP-009-00063-2: Jumper 0603 (1608 Metric); Case/Package: 0603; Mounting Technology: SMT; Pins: 2
R20 R21 = CMP-2000-00182-1: Manufacturer: Panasonic; Part Number: ERJ-3EKF1003V
R62 = CMP-2000-00180-1: Manufacturer: Panasonic; Part Number: ERJ-3EKF1001V
SW1 = CMP-10040-000029-1: SWITCH TACTILE SPST-NO 0.02A 15V; Operating Force: 240gf; Switch Travel: 0.13mm; Illumination Type: Non-Illuminated; Throw Configuration: SPST; Number of Ports: 1; Current Rating: 5A; Mechanical Life: 500000Cycles; Switch Function: Off-Mom; Connector Type: USB; Actuator Type: Standard; Gender: Receptacle; Number of Contacts: 24; Contact Plating: Gold; Insulation Color: Black; Min Operating Temperature: -40°C; Packaging: Tape and Reel; Flammability Rating: UL94 V-0; Max Operating Temperature: 85°C; Termination: Solder; Mount: Surface Mount
U1 = CMP-020-00025-2: MCU 32-Bit Ultra Low Power STM32L ARM Cortex M0+ RISC 64kB Flash 32-Pin LQFP T/R
Y2 = CMP-40224-000006-1: CRYSTAL 32.7680KHZ 12.5PF SMD; Manufacturer: ECS International; Frequency: 32.768kHz; Esr: 90kΩ; Tolerance: 20ppm; Device Class L1: Passive Components; Load Capacitance: 12.5pF; Temperature: -40°C to +85°C; ComponentLink2URL: https://ecsxtal.com/store/pdf/ECX-1210.pdf; Series: ECX-1210; Octopart: https://octopart.com/ecs-.327-12.5-1210-tr-ecs+international-81221340; ComponentLink2Description: Datasheet; Temperature Range Low: -40°C; Digikey Description: CRYSTAL 32.7680KHZ 12.5PF SMD; Lead Free: Yes; RoHS: TRUE; Device Class L3: Crystals; Automotive: No; Category: Crys; Height: 0.5mm; Manufacturer Part Number: ECS-.327-12.5-1210-TR; Temperature Range High: +85°C; Device Class L2: Crystals / Oscillators; Package: ECX-1210

## Sheet CAN_FD_INTERFACE.SchDoc
size B; SheetNumber: 4; SheetTotal: 7
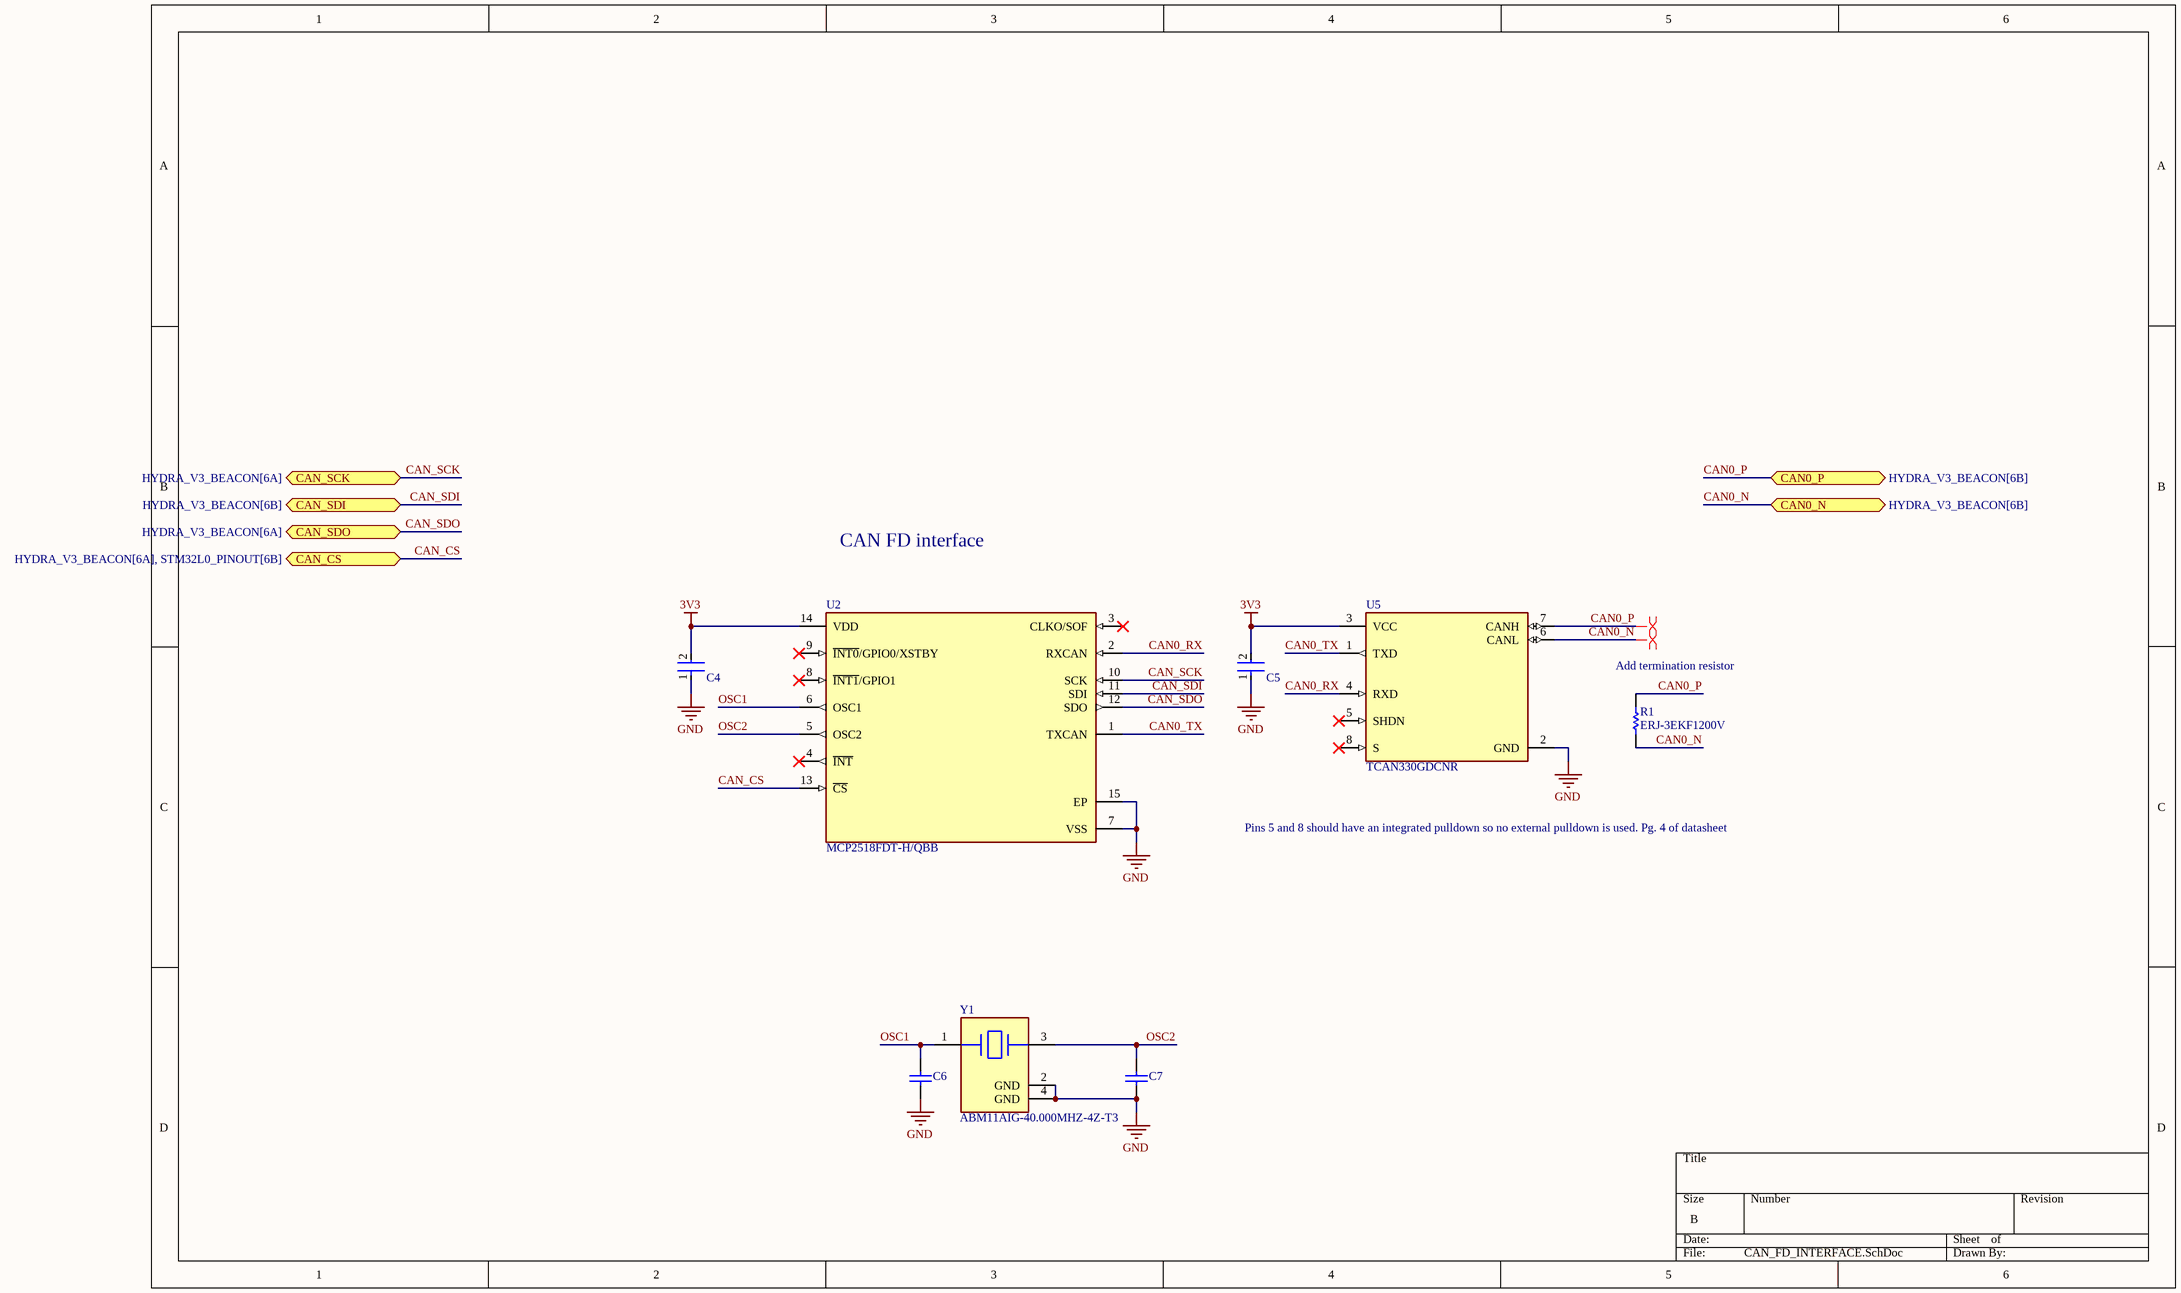
[diagram p3: CAN_FD_INTERFACE.SchDoc]

### Parts
C4  C0402C104K8PACTU  [FP-C0402-BB-MFG]  (value not drawn)
C5  C0402C104K8PACTU  [FP-C0402-BB-MFG]  (value not drawn)
C6  VJ0603D6R8CXPAJ  [CAPC1608X92X38LL15T08]  (value not drawn)
C7  VJ0603D6R8CXPAJ  [CAPC1608X92X38LL15T08]  (value not drawn)
R1  ERJ-3EKF1200V  [RESC1609X55X30ML15T15]
U2  MCP2518FDT-H/QBB  [FP-C04-21361-MFG]
U5  TCAN330GDCNR  [FP-DCN0008A-MFG]
Y1  ABM11AIG-40.000MHZ-4Z-T3  [FP-ABM11AIG-MFG]

### Ports
CAN0_N (bidir, see HYDRA_V3_BEACON[6B]), CAN0_P (bidir, see HYDRA_V3_BEACON[6B]), CAN_CS (bidir, see HYDRA_V3_BEACON[6A], STM32L0_PINOUT[6B]), CAN_SCK (bidir, see HYDRA_V3_BEACON[6A]), CAN_SDI (bidir, see HYDRA_V3_BEACON[6B]), CAN_SDO (bidir, see HYDRA_V3_BEACON[6A])

### Nets
3V3: C4.2 C5.2 U2.14(VDD) U5.3(VCC)
GND: C4.1 C5.1 C6.1 C7.1 U2.7(VSS) U2.15(EP) U5.2(GND) Y1.2(GND) Y1.4(GND)
CAN0_N: R1.1 U5.6(CANL) ; port CAN0_N
CAN0_P: R1.2 U5.7(CANH) ; port CAN0_P
CAN0_RX: U2.2(RXCAN) U5.4(RXD)
CAN0_TX: U2.1(TXCAN) U5.1(TXD)
CAN_CS: U2.13(~{CS}) ; port CAN_CS
CAN_SCK: U2.10(SCK) ; port CAN_SCK
CAN_SDI: U2.11(SDI) ; port CAN_SDI
CAN_SDO: U2.12(SDO) ; port CAN_SDO
OSC1: C6.2 U2.6(OSC1) Y1.1(1_Crystal)
OSC2: C7.2 U2.5(OSC2) Y1.3(2_Crystal)

Not connected (* = marked no-connect by the designer): U2 3(CLKO/SOF)* 4(~{INT})* 8(~{INT1}/GPIO1)* 9(~{INT0}/GPIO0/XSTBY)*; U5 5(SHDN)* 8(S)*

### Layout directives
differential pair: CAN0_N, CAN0_P

### Notes on the sheet
- CAN FD interface
- (near R1) Add termination resistor
- Pins 5 and 8 should have an integrated pulldown so no external pulldown is used. Pg. 4 of datasheet

### Library data of the parts
C4 C5 = CMP-2008-02046-2: as C16 on sheet OC_PROT; Package: C0402-BB; Temperature: -55°C to +125°C; ComponentLink2Description: Datasheet; Temperature Characteristic: X5R; Device Class L1: Passive Components; Height: 0.55mm; Lead Free: Yes; ComponentLink2URL: https://content.kemet.com/datasheets/KEM_C1002_X7R_SMD.pdf; Device Class L2: Capacitors; Temperature Range Low: -55°C; Temperature Range High: +125°C; RoHS: TRUE; Octopart: https://octopart.com/c0402c104k8pactu-kemet-140039; Automotive: No; Mouser Description: Capacitor 100 nF 10 VDC 0402; Category: Cap; Voltage Rating: 10 V; Digikey Description: CAP CER 0.1UF 10V X5R 0402; Ipc Land Pattern Name: CAPC10050X50; Device Class L3: Ceramic Capacitors; Manufacturer Part Number: C0402C104K8PACTU
C6 C7 = CMP-2006-01956-1: Manufacturer: Vitramon; Part Number: VJ0603D6R8CXPAJ
R1 = CMP-2000-00213-2: Chip Resistor, 120 Ohm, +/- 1%, 0.1 W, -55 to 155 degC, 0603 (1608 Metric), RoHS, Tape and Reel; Manufacturer: Panasonic; Power Rating: 100mW; Voltage Rating (DC): 75V; Resistance: 120Ohm; Temperature Coefficient: 100ppm/degreesC; Number of Terminations: 2; Military Standard: Not; Tolerance: 1%; Min Operating Temperature: -55degC; Packaging: TapeandReel; Lead Free: LeadFree; Max Operating Temperature: 155degC; Manufacturer URL: http://www.panasonic.com/; Case Code (Imperial): 0603; REACH SVHC: NoSVHC; Width: 0.031inch; Datasheet URL: https://industrial.panasonic.com/cdbs/www-data/pdf/RDA0000/AOA0000C283.pdf; RoHSCompliant: true; Max Power Dissipation: 100mW; Termination: SMD/SMT; Package Reference: 0603; Height: 0.022inch; Depth: 0.8mm; Package Description: 2-Pin Surface Mount Device, Body 1.6 x 0.85 mm; Contact Plating: Tin; Length: 1.6mm; Package URL: http://www.st.com/st-web-ui/static/active/en/resource/technical/document/datasheet/CD00001320.pdf; Radiation Hardening: No; Package Quantity: 1; Number of Pins: 2; Datasheet Version: 42095.0; Voltage Rating: 75V; Composition: ThickFilm; Case/Package: 0603; Mount: SurfaceMount; Case Code (Metric): 1608
U2 = CMP-06298-000029-1: IC CAN CONTROLLER SPI 14VDFN; RoHS Compliant: Yes
U5 = CMP-04872-000178-1: IC TRANSCEIVER 1/1 SOT23-8; Data Rate: 1Mbps; Packaging: Tape and Reel; Min Operating Temperature: -40°C; Max Operating Temperature: 125°C; RoHS Compliant: Yes; Lead Free: Lead Free; Case/Package: SOT-23-8; Mount: Surface Mount
Y1 = CMP-27762-004352-1: Crystal 40MHz ±30ppm 10pF SMD-4 2mm x 1.6mm Automotive; ESR (Equivalent Series Resistance): 60R; Frequency Stability: 50ppm; Max Operating Temperature: 125°C; Ratings: AEC-Q200; Color: Yellow; Frequency: 40MHz; Width: 0.063inch; Packaging: Tape and Reel; RoHS Compliant: Yes; Case/Package: SMD/SMT; Load Capacitance: 10pF; Frequency Tolerance: 30ppm; Length: 0.079inch; Min Operating Temperature: -40°C; Mount: Surface Mount; Height: 0.022inch

## Sheet GPS.SchDoc
size B; SheetNumber: 5; SheetTotal: 7
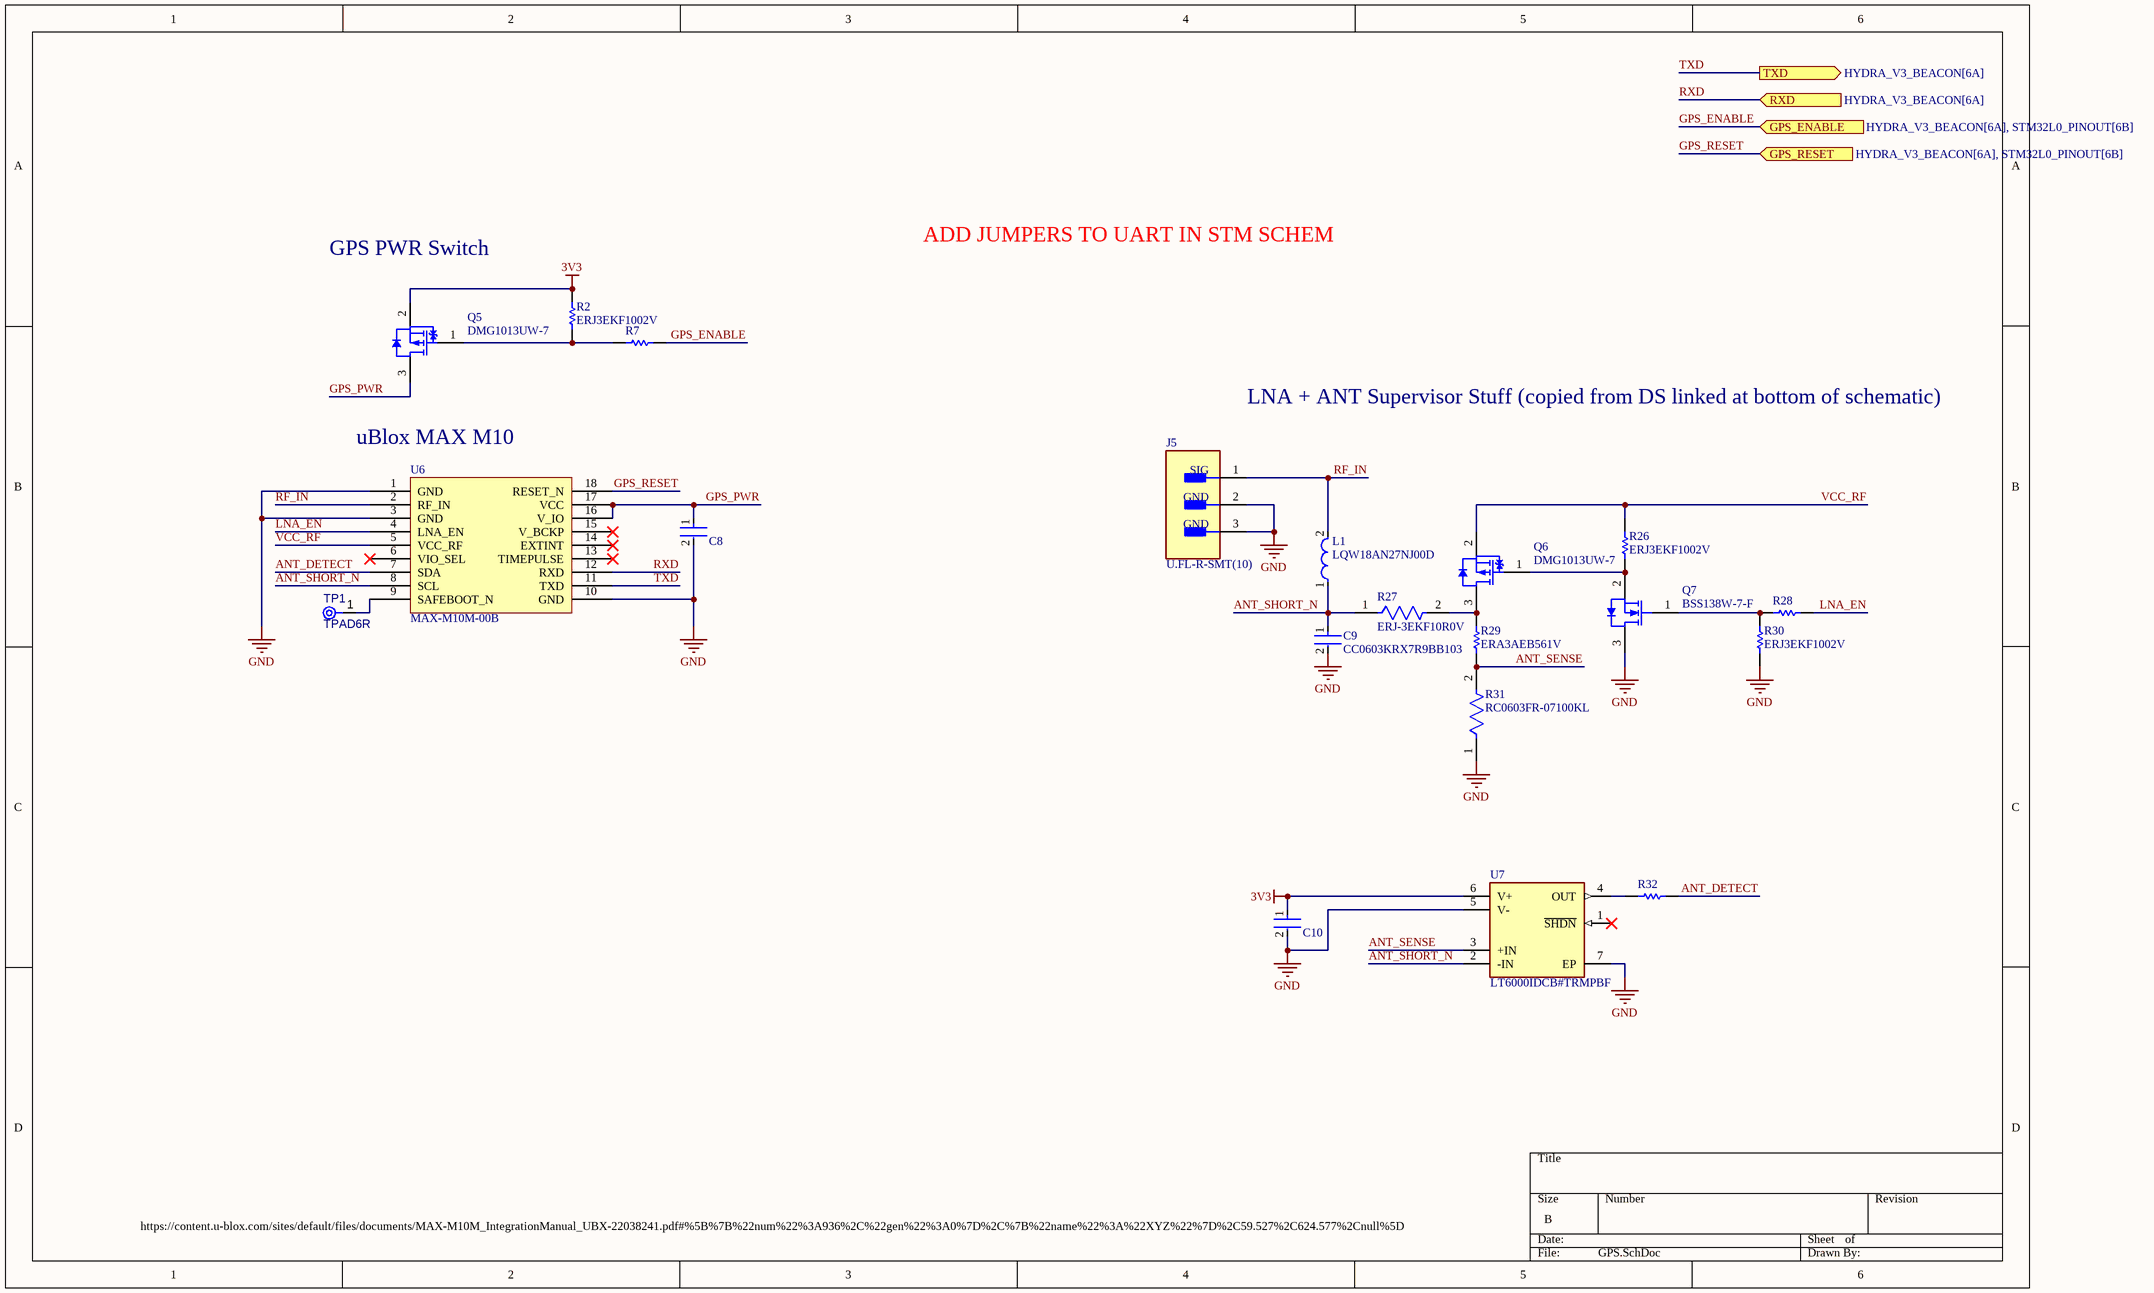
[diagram p4: GPS.SchDoc]

### Parts
C8  C0402C104K8PACTU  [FP-C0402-BB-MFG]  (value not drawn)
C9  CC0603KRX7R9BB103  [FP-CC0603-DA-MFG]
C10  C0402C104K8PACTU  [FP-C0402-BB-MFG]  (value not drawn)
J5  U.FL-R-SMT(10)  [FP-U_FL-R-SMT_10-MFG]
L1  LQW18AN27NJ00D  [FP-LQW18AN_00-MFG]
Q5  DMG1013UW-7  [DIOD-SOT323-3_V]
Q6  DMG1013UW-7  [DIOD-SOT323-3_V]
Q7  BSS138W-7-F  [DIOD-SOT323-3_V]
R2  ERJ3EKF1002V  [RESC1609X55X30LL15T15]
R7  ERJ-3EKF1001V  [RESC1608X55X30LL15T15]  (value not drawn)
R26  ERJ3EKF1002V  [RESC1609X55X30LL15T15]
R27  ERJ-3EKF10R0V  [FP-ERJ3EK-MFG]
R28  ERJ-3EKF1001V  [RESC1608X55X30LL15T15]  (value not drawn)
R29  ERA3AEB561V  [RESC1608X55X30LL20T20]
R30  ERJ3EKF1002V  [RESC1609X55X30LL15T15]
R31  RC0603FR-07100KL  [FP-RC0603-0_55-MFG]
R32  ERJ-3EKF1001V  [RESC1608X55X30LL15T15]  (value not drawn)
TP1  TPAD6R  [TP06R]  (no BOM)
U6  MAX-M10M-00B  [CAC-110P1035X969-18N]
U7  LT6000IDCB#TRMPBF  [FP-DCB-6-05-08-1715-MFG]

### Ports
GPS_ENABLE (in, see HYDRA_V3_BEACON[6A], STM32L0_PINOUT[6B]), GPS_RESET (in, see HYDRA_V3_BEACON[6A], STM32L0_PINOUT[6B]), RXD (in, see HYDRA_V3_BEACON[6A]), TXD (out, see HYDRA_V3_BEACON[6A])

### Nets
3V3: C10.1 Q5.2(S) R2.2 U7.6(V+)
GND: C8.2 C9.2 C10.2 J5.2(GND) J5.3(GND) Q7.3(D) R30.1 R31.1 U6.1(GND) U6.3(GND) U6.10(GND) U7.5(V-) U7.7(EP)
ANT_DETECT: R32.1 U6.7(SDA)
ANT_SENSE: R29.1 R31.2 U7.3(+IN)
ANT_SHORT_N: C9.1 L1.1 R27.1 U6.8(SCL) U7.2(-IN)
GPS_ENABLE: R7.1 ; port GPS_ENABLE
GPS_PWR: C8.1 Q5.3(D) U6.16(V_IO) U6.17(VCC)
GPS_RESET: U6.18(RESET_N) ; port GPS_RESET
LNA_EN: R28.1 U6.4(LNA_EN)
RF_IN: J5.1(SIG) L1.2 U6.2(RF_IN)
RXD: U6.12(RXD) ; port RXD
TXD: U6.11(TXD) ; port TXD  [project net GPS_STAT_LED]
VCC_RF: Q6.2(S) R26.2 U6.5(VCC_RF)
NetQ5_1: Q5.1(G) R2.1 R7.2
NetQ6_1: Q6.1(G) Q7.2(S) R26.1
NetQ6_3: Q6.3(D) R27.2 R29.2
NetQ7_1: Q7.1(G) R28.2 R30.2
NetR32_2: R32.2 U7.4(OUT)
NetTP1_1: TP1.1(TP) U6.9(SAFEBOOT_N)

Not connected (* = marked no-connect by the designer): U6 6(VIO_SEL)* 13(TIMEPULSE)* 14(EXTINT)* 15(V_BCKP)*; U7 1(~{SHDN})*

### Notes on the sheet
- GPS PWR Switch
- ADD JUMPERS TO UART IN STM SCHEM
- LNA + ANT Supervisor Stuff (copied from DS linked at bottom of schematic)
- (near U6) uBlox MAX M10
- https://content.u-blox.com/sites/default/files/documents/MAX-M10M_IntegrationManual_UBX-22038241.pdf#%5B%7B%22num%22%3A936%2C%22gen%22%3A0%7D%2C%7B%22name%22%3A%22XYZ%22%7D%2C59.527%2C624.577%2Cnull%5D

### Library data of the parts
C8 C10 = CMP-2008-02046-2: as C16 on sheet OC_PROT; Package: C0402-BB; Temperature: -55°C to +125°C; ComponentLink2Description: Datasheet; Temperature Characteristic: X5R; Device Class L1: Passive Components; Height: 0.55mm; Lead Free: Yes; ComponentLink2URL: https://content.kemet.com/datasheets/KEM_C1002_X7R_SMD.pdf; Device Class L2: Capacitors; Temperature Range Low: -55°C; Temperature Range High: +125°C; RoHS: TRUE; Octopart: https://octopart.com/c0402c104k8pactu-kemet-140039; Automotive: No; Mouser Description: Capacitor 100 nF 10 VDC 0402; Category: Cap; Voltage Rating: 10 V; Digikey Description: CAP CER 0.1UF 10V X5R 0402; Ipc Land Pattern Name: CAPC10050X50; Device Class L3: Ceramic Capacitors; Manufacturer Part Number: C0402C104K8PACTU
C9 = CMP-2100-03600-2: CAP CER 10000PF 50V X7R 0603; Manufacturer: YAGEO; Tolerance: 0.1; Material: Ceramic; Temperature Coefficient: 15%; Value: 10 nF; Mouser Description: Multilayer Ceramic Capacitor, CC Series, 0.01 - F, - 10%, X7R, 50 V, 0603 [1608 Metric]; Digikey Description: CAP CER 10000PF 50V X7R 0603; Height: 0.9mm; Category: Cap; Temperature Characteristic: X7R; Footprint Url: http://www.yageo.com/exep/pages/download/literatures/UPY-C_GEN_24.pdf; Lead Free: Yes; Voltage Rating: 50 V; Manufacturer Part Number: CC0603KRX7R9BB103; Temperature: -55°C to +125°C; Device Class L3: Ceramic Capacitors; ComponentLink2Description: Datasheet; Voltage: 50 V; Package: CC0603-DA; Octopart: https://octopart.com/cc0603krx7r9bb103-yageo-192938; Automotive: No; Temperature Range High: +125°C; Temperature Range Low: -55°C; RoHS: TRUE; Device Class L1: Passive Components; ComponentLink2URL: http://www.yageo.com/documents/recent/UPY-GPHC_X7R_6.3V-to-50V_18.pdf; Device Class L2: Capacitors; Capacitance: 10 nF
J5 = CMP-0029-00003-2: CONN U.FL RCPT STR 50 OHM SMD; Plating: Silver; Connector Type: Coaxial; Frequency: 6GHz; Impedance: 50R; Body Material: Bronze; Dielectric Material: Polymer; Contact Plating: Gold; Termination: Solder; Orientation: Vertical; Contact Material: Brass; Min Operating Temperature: -40°C; Mount: Surface Mount; Lead Free: Lead Free; Max Operating Temperature: 90°C; Radiation Hardening: No; Packaging: Tape and Reel; Body Plating: Silver; Fastening Type: Snap; Max Frequency: 6GHz; Depth: 3.1mm; Package Quantity: 1; Case/Package: SMD/SMT; Housing Color: Beige; Length: 3mm
L1 = CMP-06042-013840-1: Wire Wound RF Inductor 27nH ±5% 440mA 0.21Ω 0603 (1608); Shielding: Unshielded; Test Frequency: 100MHz; Q Factor: 40; Self Resonant Frequency: 3.7GHz; DC Resistance (DCR): 210mR; Core Material: Non-Magnetic; Depth: 1mm; Min Operating Temperature: -55°C; Package Quantity: 4000; Inductance: 27nH; Case Code (Metric): 1608; Height - Seated (Max): 0.039inch; Resistor Type: Wirewound; Max DC Current: 440mA; Tolerance: 5%; Length: 1.6mm; Mount: Surface Mount; DC Current: 440mA; Packaging: Tape and Reel; Lead Free: Lead Free; Case Code (Imperial): 0603; Current Rating: 440mA; Width: 0.8mm; Max Operating Temperature: 125°C; Termination: SMD/SMT; Weight: 0.000106oz; Radiation Hardening: No; Height: 0.8mm; Case/Package: 0603; Military Standard: Not
Q5 Q6 = CMP-2000-06170-1: P-Channel Enhancement Mode MOSFET, 310 mW, 20 V, -55 to 150 degC, 3-Pin SOT-323, RoHS, Tape and Reel; Manufacturer: Diodes Inc; Qg Gate Charge: 0.622nC; Drain-Source On Resistance-Max: 750mO; Rated Power Dissipation: 310mW; Drain-to-Source Voltage [Vdss]: 20V; Package Reference: SOT323; Datasheet Version: Rev. 3-2, 09/2013; Package Description: 3-Pin Small Outline Transistor, Body 2 x 1.25 mm, Pitch 0.65 mm; Mounting Technology: SurfaceMount; Manufacturer URL: http://www.diodes.com/; Datasheet URL: http://www.diodes.com/_files/datasheets/ds31861.pdf; Channel Type: P-Channel
Q7 = CMP-2000-05968-1: as Q14 on sheet STM32L0_PINOUT; Manufacturer URL: http://www.diodes.com/; Series: BSS138; Package Description: 3-Pin Small Outline Transistor, Body 2 x 1.25 mm, Pitch 0.65 mm; Mounting Technology: SurfaceMount; Product Category: MOSFET; RoHS: True; Maximum Operating Temperature: +150C; Height: 1mm; Length: 2.2mm; Technology: Si; Width: 1.35mm; Datasheet URL: http://www.diodes.com/_files/datasheets/ds30206.pdf; Manufacturer: DiodesIncorporated; Package / Case: SOT-323-3; Typical Turn-On Delay Time: 20ns; Transistor Polarity: N-Channel; Factory Pack Quantity: 3000; Packaging: Reel; Product: MOSFETSmallSignal; Datasheet Version: Rev. 11-2, 09/2013; Package Reference: SOT323; Minimum Operating Temperature: -55C; Mounting Style: SMD/SMT; Channel Mode: Enhancement
R2 R26 R30 = CMP-1012-00623-3: as R33 on sheet HYDRA_V3_BEACON; Number of Pins: 2; Package Reference: 603; Depth: 0.8mm; Mount: SurfaceMount; Package Description: 2-Pin Surface Mount Device, Body 1.6 x 0.85 mm; Datasheet Version: 02/2017; Length: 1.6mm; Lead Free: LeadFree; Height: 0.45mm; Number of Terminations: 2; Max Power Dissipation: 100mW; Min Operating Temperature: -55degC; Datasheet URL: https://industrial.panasonic.com/cdbs/www-data/pdf/RDA0000/AOA0000C304.pdf; Termination: SMD/SMT; Case Code (Metric): 1608; Case Code (Imperial): 0603; Tolerance: 1%; Max Operating Temperature: 155degC; RoHSCompliant: true; Voltage Rating (DC): 75V; Radiation Hardening: No; Packaging: TapeandReel; Composition: ThickFilm; Mounting Technology: SurfaceMount; Manufacturer URL: http://www.panasonic.com/; Width: 0.031inch; REACH SVHC: NoSVHC; Contact Plating: Tin; Military Standard: Not; Package Quantity: 1
R7 R28 R32 = CMP-2000-00180-1: Manufacturer: Panasonic; Part Number: ERJ-3EKF1001V
R27 = CMP-2000-00195-2: RES SMD 10 OHM 1% 1/10W 0603; Manufacturer: Panasonic; Resistance: 10Ω; Voltage Rating: 75V; Value: 10Ω; Power: 100mW; Power Rating: 0.1W; Temperature Coefficient: 100ppm/°C; Automotive Grade: Grade 0; Lead Free: Yes; Device Class L1: Passive Components; Digikey Description: RES SMD 10 OHM 1% 1/10W 0603; Octopart: https://octopart.com/erj-3ekf10r0v-panasonic-55403649; Automotive: Yes; ComponentLink2URL: https://b2b-api.panasonic.eu/file_stream/pids/fileversion/1263; Manufacturer Part Number: ERJ-3EKF10R0V; Height: 0.55mm; Temperature Range High: +155°C; Footprint Url: https://industrial.panasonic.com/cdbs/www-data/pdf/RDA0000/DMA0000COL17.pdf; Temperature: -55°C to +155°C; Tolerance: 1%; ComponentLink2Description: Datasheet; Package: ERJ3EK; Device Class L2: Resistors; Category: Res; Ipc Land Pattern Name: RESC16080X45; RoHS: TRUE; Composition: Thick Film; Device Class L3: Chip SMD Resistors; Temperature Range Low: -55°C; Series: ERJ
R29 = CMP-2000-00091-1: Manufacturer: Panasonic; Part Number: ERA3AEB561V
R31 = CMP-2100-03662-2: RES SMD 100K OHM 1% 1/10W 0603; Voltage Rating (DC): 50V; Resistance: 100kR; Max Power Dissipation: 100mW; Temperature Coefficient: 100ppm/°C; Working Voltage: 75V; Length: 1.6mm; Lead Free: Lead Free; Number of Terminations: 2; Packaging: Tape and Reel; Voltage Rating: 50V; Termination: SMD/SMT; Width: 0.8mm; Resistor Type: Thick Film; Resistance Tolerance: 1%; Features: Moisture Resistant; Height: 0.45mm; Construction: Rectangular; Case/Package: 0603; Military Standard: Not; Case Code (Imperial): 0603; Series: RC; Technology: THICK FILM; Depth: 0.8mm; RoHS Compliant: Yes; REACH SVHC: No SVHC; Min Operating Temperature: -55°C; Case Code (Metric): 1608; Max Operating Temperature: 155°C; Power Rating: 100mW; Number of Pins: 2; Tolerance: 1%
TP1 = CMP-00028-00002-2: 0.6mm round; Pins: 1
U6 = CMP-00025-00004-1: Gnss Lcc Rx Mod, Rom, Crystal
U7 = CMP-09116-000039-1: IC OPAMP GP 1 CIRCUIT 6DFN; Number of Elements: 1; Power Supply Rejection Ratio (PSRR): 86dB; Output Current per Channel: 10mA; Gain Bandwidth Product: 60kHz; Operating Supply Current: 20uA; Input Bias Current: 12nA; Voltage Gain: 120dB; Max Supply Voltage: 18V; Input Offset Voltage (Vos): 1.2mV; Min Supply Voltage: 1.8V; Slew Rate: 0.018V/µs; Common Mode Rejection Ratio: 68dB; Packaging: Tape and Reel; Mount: Surface Mount; Case/Package: DFN; Max Operating Temperature: 85°C; Number of Pins: 6; Number of Amplifiers: 1; REACH SVHC: No SVHC; Unity Gain Bandwidth Product: 60kHz; Bandwidth: 60kHz; Lead Free: Lead Free; Number of Circuits: 1; Min Operating Temperature: -40°C; Package Quantity: 1